# EAGLE design watch (EAGLE 7.2.0)

## Sheet 1 of 4: MCU & Power Management
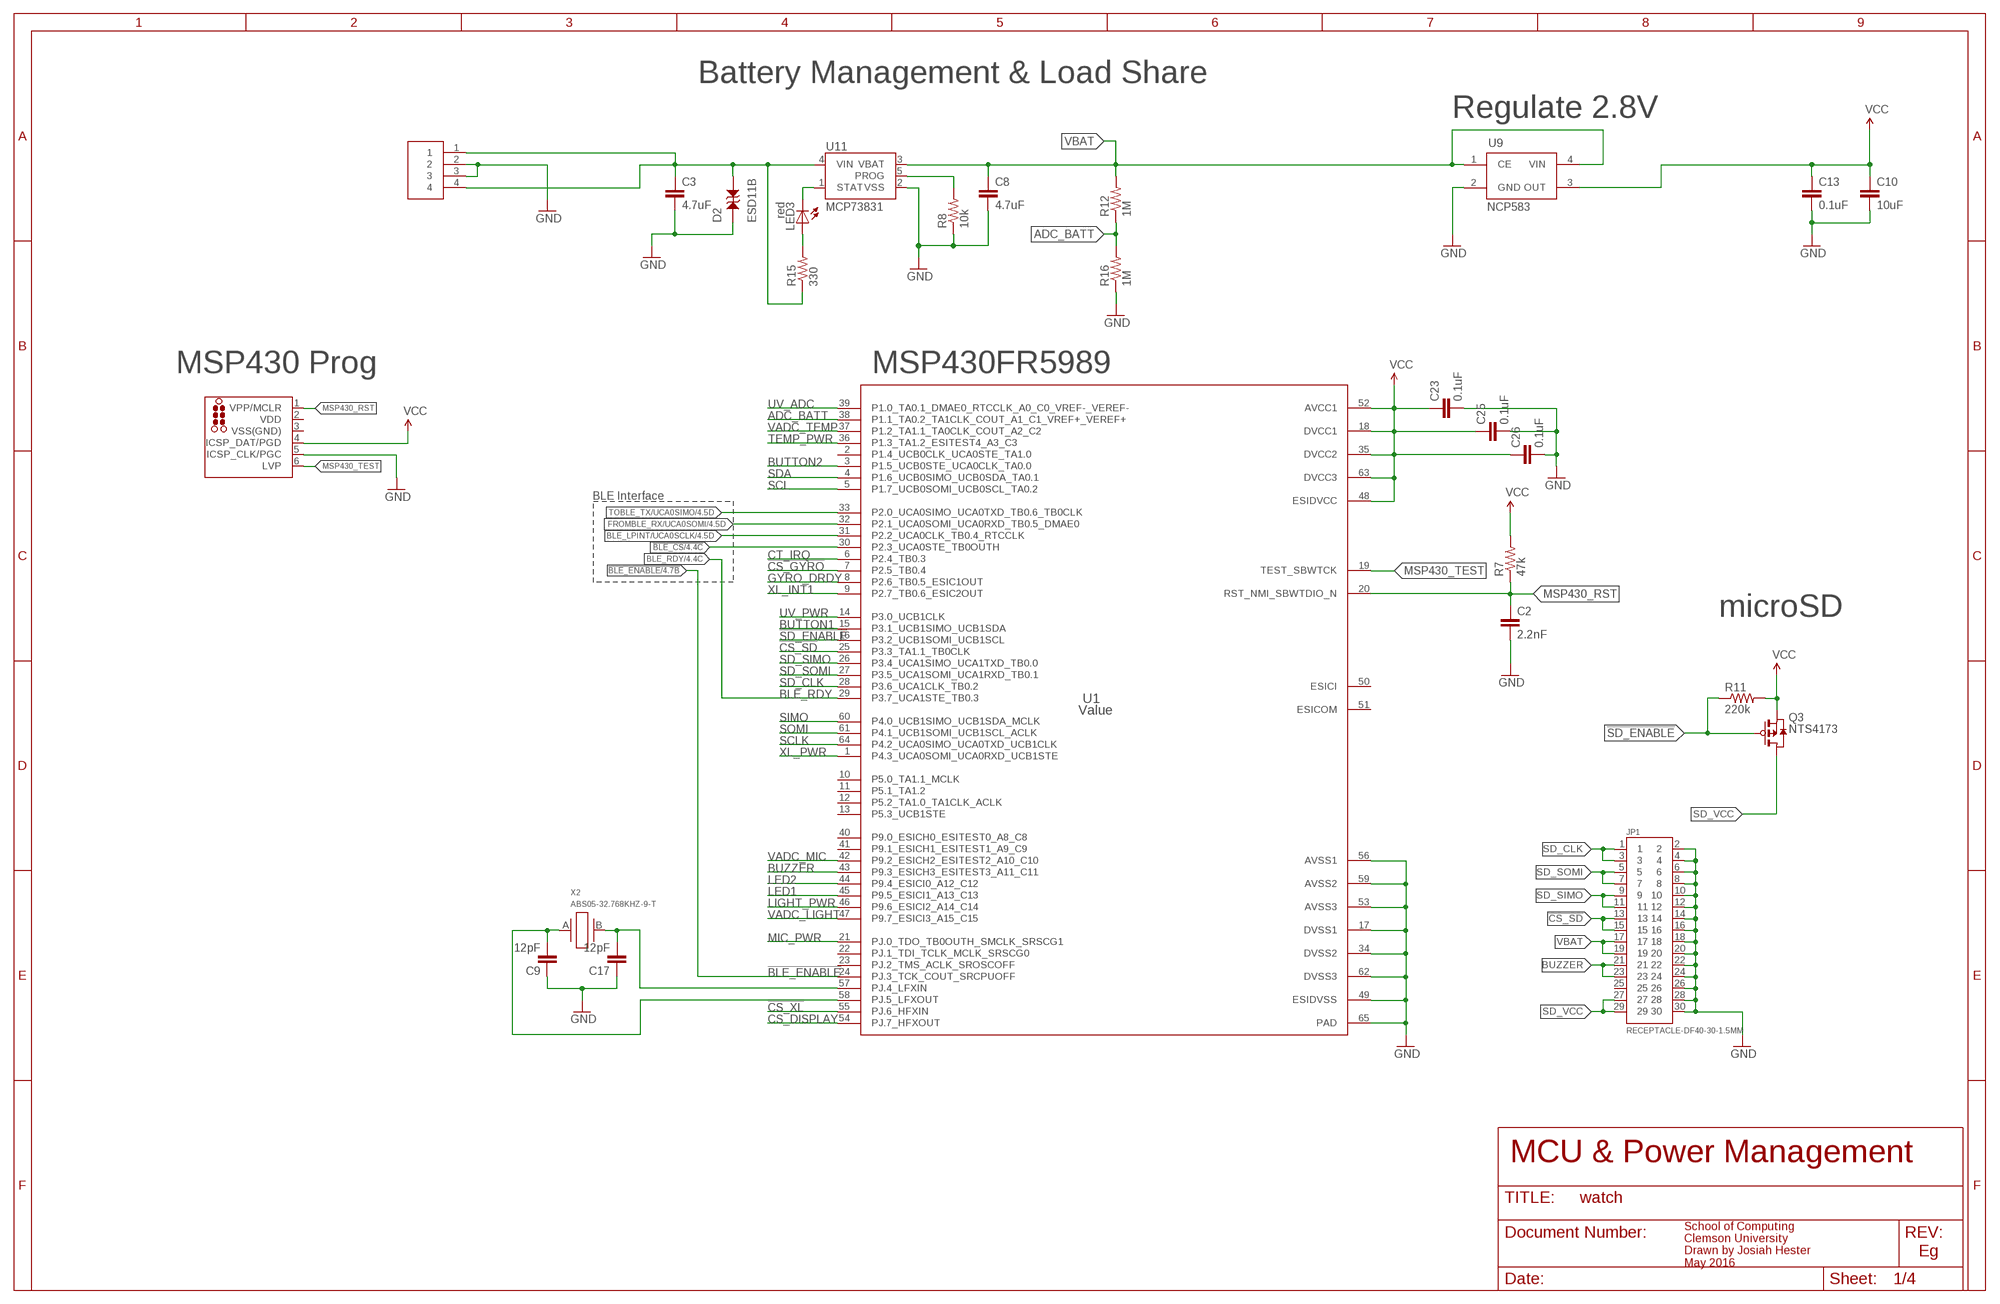
[diagram p0: schematic, sheet 1]

### Parts
C2  2.2nF  C-EU  [0402]
C3  4.7uF  CAP0805  [0805]
C8  4.7uF  CAP0805  [0805]
C9  12pF  C-EU  [0402]
C10  10uF  CAP0805  [0805]
C13  0.1uF  C-EU  [0402]
C17  12pF  C-EU  [0402]
C23  0.1uF  C-EU  [0402]
C25  0.1uF  C-EU  [0402]
C26  0.1uF  C-EU  [0402]
D2  ESD11B  [DSN2]
J1  TC2030-MCP-NL  [TC2030-MCP-NL]
JP1  RECEPTACLE-DF40-30-1.5MM  [RECEPTACLE-DF40-30-1.5MM]
JP3  1.27MM-MILLMAX  [1X03-1.27MM]
LED3  red  LED0603  [LED-0603]
Q3  NTS4173  [SC-70-3]
R7  47k  R-EU  [0402]
R8  10k  R-EU  [0402]
R11  220k  R-EU  [0402]
R12  1M  R-EU  [0402]
R15  330  R-EU  [0402]
R16  1M  R-EU  [0402]
U1  Value  MSP430FR5989IRGCR  [RGC0064B]
U9  NCP583  [SC82-AB_1PRIMARY]
U11  MCP73831  [SOT23-5]
X2  ABS05-32.768KHZ-9-T  [ABS05]

### Nets
!BLE_CS: U1.30(P2.3_UCA0STE_TB0OUTH) ; also sheet 4
!BLE_ENABLE: U1.24(PJ.3_TCK_COUT_SRCPUOFF) ; also sheet 4
!CS_GYRO: U1.7(P2.5_TB0.4) ; also sheet 3
!CS_SD: JP1.13 JP1.15 U1.25(P3.3_TA1.1_TB0CLK)
!CS_XL: U1.55(PJ.6_HFXIN) ; also sheet 3
!SD_ENABLE: Q3.P1(G) R11.1 U1.16(P3.2_UCB1SOMI_UCB1SCL)
ADC_BATT: R12.1 R16.2 U1.38(P1.1_TA0.2_TA1CLK_COUT_A1_C1_VREF+_VEREF+)
BLE_LPINT/UCA0SCLK: U1.31(P2.2_UCA0CLK_TB0.4_RTCCLK) ; also sheet 4
BLE_RDY: U1.29(P3.7_UCA1STE_TB0.3) ; also sheet 4
BUTTON1: U1.15(P3.1_UCB1SIMO_UCB1SDA) ; also sheet 2
BUTTON2: U1.3(P1.5_UCB0STE_UCA0CLK_TA0.0) ; also sheet 2
BUZZER: JP1.21 JP1.23 U1.43(P9.3_ESICH3_ESITEST3_A11_C11)
CS_DISPLAY: U1.54(PJ.7_HFXOUT) ; also sheet 2
CT_IRQ: U1.6(P2.4_TB0.3) ; also sheet 2
FROMBLE_RX/UCA0SOMI: U1.32(P2.1_UCA0SOMI_UCA0RXD_TB0.5_DMAE0) ; also sheet 4
GND: C2.2 C3.2 C8.2 C9.1 C10.2 C13.2 C17.1 C23.2 C25.2 C26.2 D2.P$1 J1.5(ICSP_CLK/PGC) JP1.2 JP1.4 JP1.6 JP1.8 JP1.10 JP1.12 JP1.14 JP1.16 JP1.18 JP1.20 JP1.22 JP1.24 JP1.26 JP1.28 JP1.30 JP3.2 JP3.3 R8.1 R16.1 U1.17(DVSS1) U1.34(DVSS2) U1.49(ESIDVSS) U1.53(AVSS3) U1.56(AVSS1) U1.59(AVSS2) U1.62(DVSS3) U1.65(PAD) U9.2(GND) U11.2(VSS) ; also sheet 2,3,4
GYRO_DRDY: U1.8(P2.6_TB0.5_ESIC1OUT) ; also sheet 3
LED1: U1.45(P9.5_ESICI1_A13_C13) ; also sheet 2
LED2: U1.44(P9.4_ESICI0_A12_C12) ; also sheet 2
LIGHT_PWR: U1.46(P9.6_ESICI2_A14_C14) ; also sheet 3
MIC_PWR: U1.21(PJ.0_TDO_TB0OUTH_SMCLK_SRSCG1) ; also sheet 3
MSP430_RST: C2.1 J1.1(VPP/MCLR) R7.1 U1.20(RST_NMI_SBWTDIO_N)
MSP430_TEST: J1.6(LVP) U1.19(TEST_SBWTCK)
N$3: R8.2 U11.5(PROG)
N$5: C17.2 U1.57(PJ.4_LFXIN) X2.B
N$6: C9.2 U1.58(PJ.5_LFXOUT) X2.A
N$7: LED3.C U11.1(STAT)
N$9: LED3.A R15.2
SCL: U1.5(P1.7_UCB0SOMI_UCB0SCL_TA0.2) ; also sheet 2
SCLK: U1.64(P4.2_UCA0SIMO_UCA0TXD_UCB1CLK) ; also sheet 2,3
SD_CLK: JP1.1 JP1.3 U1.28(P3.6_UCA1CLK_TB0.2)
SD_SIMO: JP1.9 JP1.11 U1.26(P3.4_UCA1SIMO_UCA1TXD_TB0.0)
SD_SOMI: JP1.5 JP1.7 U1.27(P3.5_UCA1SOMI_UCA1RXD_TB0.1)
SD_VCC: JP1.27 JP1.29 Q3.P3(D)
SDA: U1.4(P1.6_UCB0SIMO_UCB0SDA_TA0.1) ; also sheet 2
SIMO: U1.60(P4.0_UCB1SIMO_UCB1SDA_MCLK) ; also sheet 2,3
SOMI: U1.61(P4.1_UCB1SOMI_UCB1SCL_ACLK) ; also sheet 3
TEMP_PWR: U1.36(P1.3_TA1.2_ESITEST4_A3_C3) ; also sheet 3
TOBLE_TX/UCA0SIMO: U1.33(P2.0_UCA0SIMO_UCA0TXD_TB0.6_TB0CLK) ; also sheet 4
UV_ADC: U1.39(P1.0_TA0.1_DMAE0_RTCCLK_A0_C0_VREF-_VEREF-) ; also sheet 3
UV_PWR: U1.14(P3.0_UCB1CLK) ; also sheet 3
VADC_LIGHT: U1.47(P9.7_ESICI3_A15_C15) ; also sheet 3
VADC_MIC: U1.42(P9.2_ESICH2_ESITEST2_A10_C10) ; also sheet 3
VADC_TEMP: U1.37(P1.2_TA1.1_TA0CLK_COUT_A2_C2) ; also sheet 3
VBAT: C8.1 JP1.17 JP1.19 R12.2 U9.1(CE) U9.4(VIN) U11.3(VBAT)
VCC: C10.1 C13.1 C23.1 C25.1 C26.1 J1.4(ICSP_DAT/PGD) Q3.P2(S) R7.2 R11.2 U1.18(DVCC1) U1.35(DVCC2) U1.48(ESIDVCC) U1.52(AVCC1) U1.63(DVCC3) U9.3(OUT) ; also sheet 2,3,4
VIN: C3.1 D2.P$2 JP3.1 JP3.4 R15.1 U11.4(VIN)
XL_INT1: U1.9(P2.7_TB0.6_ESIC2OUT) ; also sheet 3
XL_PWR: U1.1(P4.3_UCA0SOMI_UCA0RXD_UCB1STE) ; also sheet 3
Unconnected: JP1.25 U1.2(P1.4_UCB0CLK_UCA0STE_TA1.0) U1.10(P5.0_TA1.1_MCLK) U1.11(P5.1_TA1.2) U1.12(P5.2_TA1.0_TA1CLK_ACLK) U1.13(P5.3_UCB1STE) U1.22(PJ.1_TDI_TCLK_MCLK_SRSCG0) U1.23(PJ.2_TMS_ACLK_SROSCOFF) U1.40(P9.0_ESICH0_ESITEST0_A8_C8) U1.41(P9.1_ESICH1_ESITEST1_A9_C9) U1.50(ESICI) U1.51(ESICOM)

### Notes on the sheet
- Battery Management & Load Share
- Regulate 2.8V
- MSP430 Prog | MSP430FR5989
- BLE Interface
- microSD
- MCU & Power Management
- Eg
- School of Computing
  Clemson University
  Drawn by Josiah Hester
  May 2016

## Sheet 2 of 4: User Interface
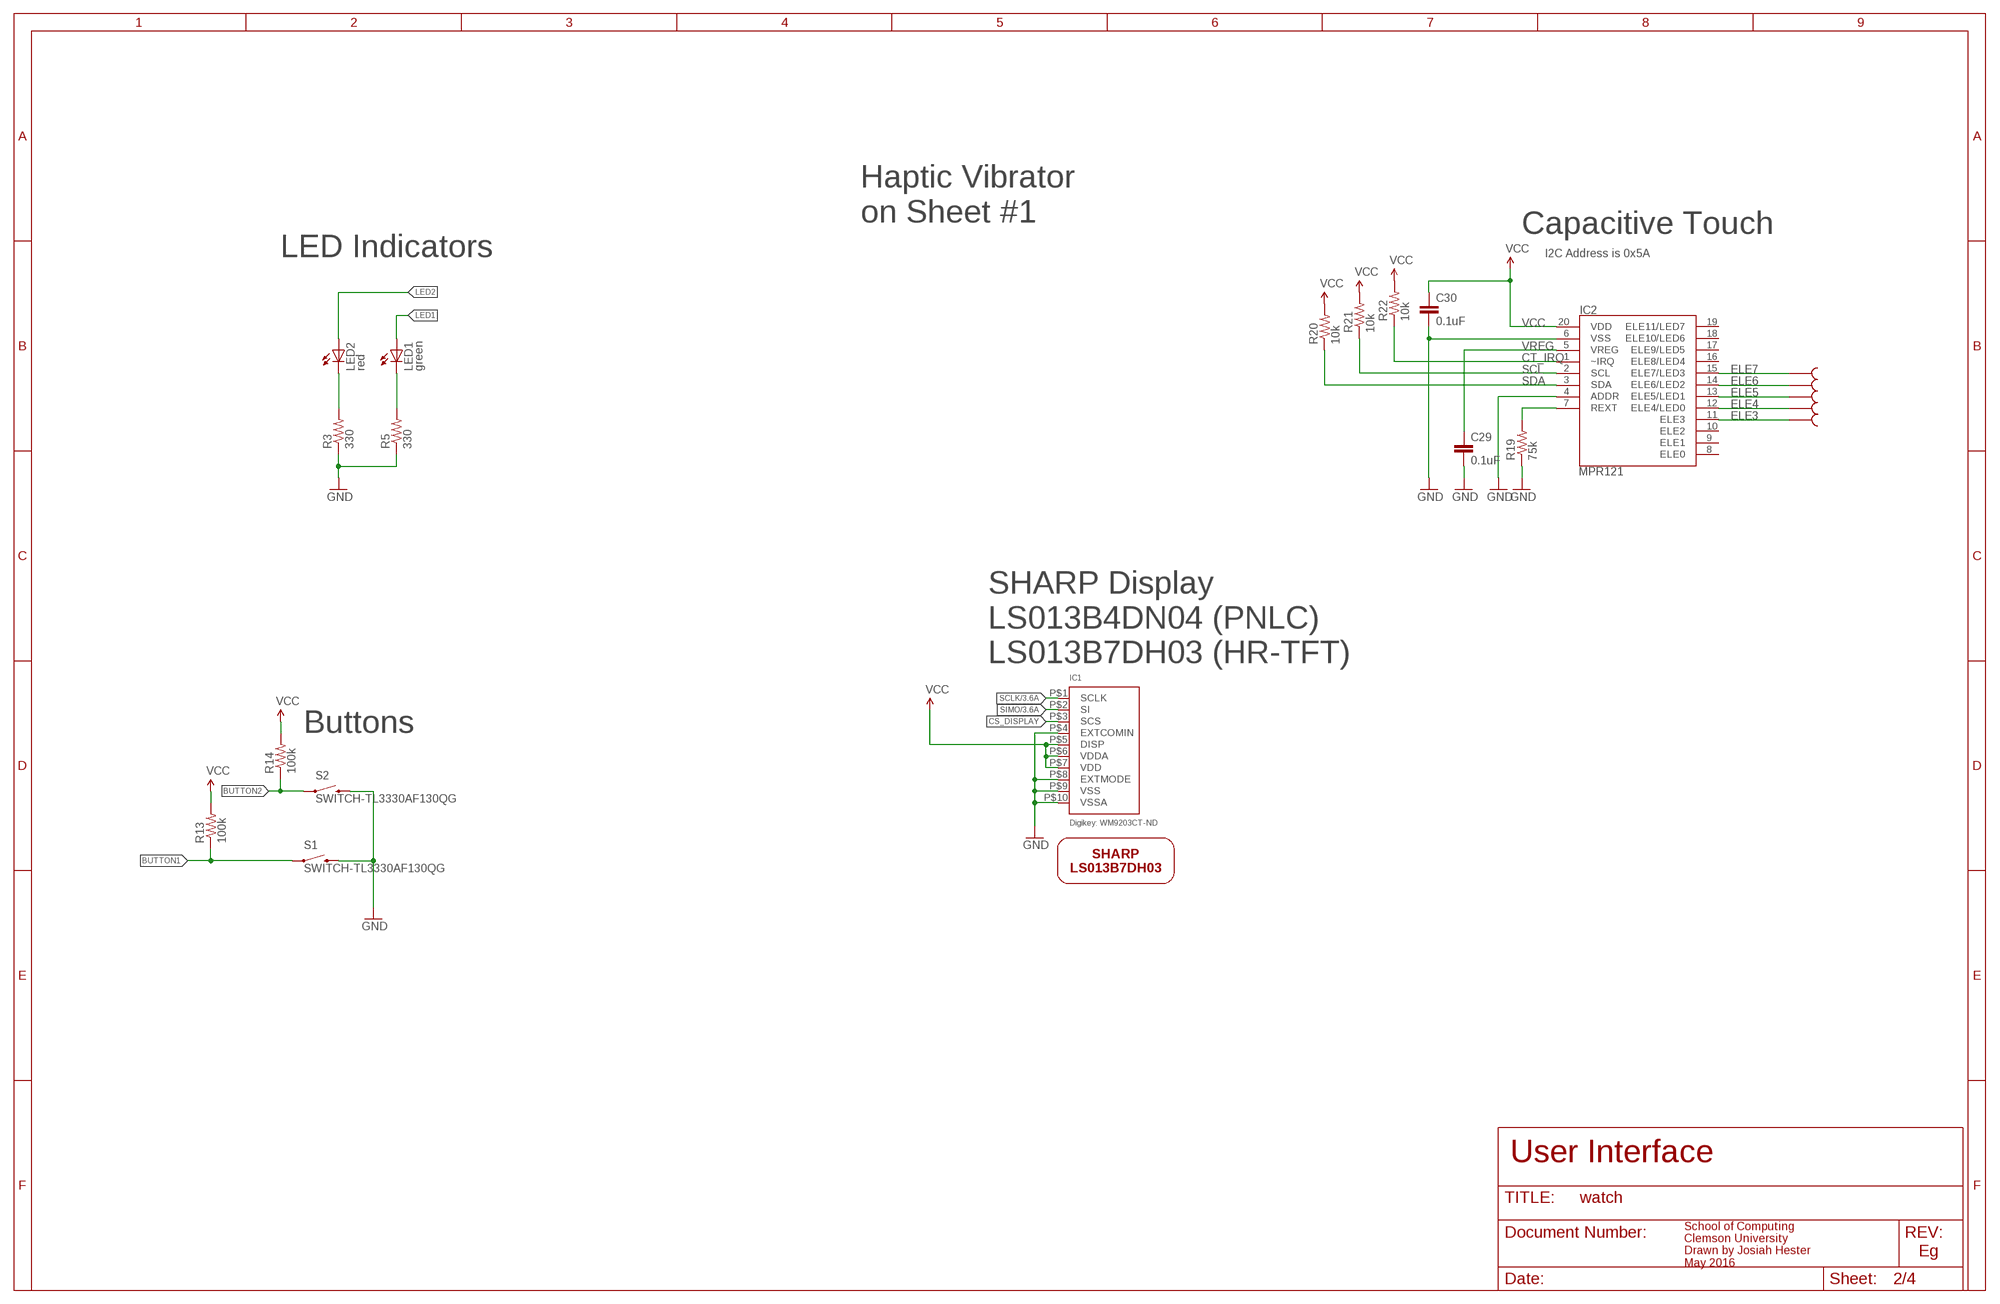
[diagram p1: schematic, sheet 2]

### Parts
C29  0.1uF  C-EU  [0402]
C30  0.1uF  C-EU  [0402]
IC1  Digikey: WM9203CT-ND  SHARP_MEMORYLCD_10PIN  [FPC_10PIN_52892-1095]
IC2  MPR121  MPR121V2  [QFN-20-0.4MM-V2]
LED1  green  LED0603  [LED-0603]
LED2  red  LED0603  [LED-0603]
R3  330  R-EU  [0402]
R5  330  R-EU  [0402]
R13  100k  R-EU  [0402]
R14  100k  R-EU  [0402]
R19  75k  R-EU  [0402]
R20  10k  R-EU  [0402]
R21  10k  R-EU  [0402]
R22  10k  R-EU  [0402]
S1  SWITCH-TL3330AF130QG  [TL3330AF130QG]
S2  SWITCH-TL3330AF130QG  [TL3330AF130QG]
U$3  LS013B7DH03  [LS013B7DH03_HF]
U$6  CTPAD  [CTPAD]
U$7  CTPAD  [CTPAD]
U$8  CTPAD  [CTPAD]
U$9  CTPAD  [CTPAD]
U$10  CTPAD  [CTPAD]

### Nets
BUTTON1: R13.1 S1.2 ; also sheet 1
BUTTON2: R14.1 S2.2 ; also sheet 1
CS_DISPLAY: IC1.P$3(SCS) ; also sheet 1
CT_IRQ: IC2.1(~IRQ) R22.1 ; also sheet 1
ELE3: IC2.11(ELE3) U$10.P$1
ELE4: IC2.12(ELE4/LED0) U$9.P$1
ELE5: IC2.13(ELE5/LED1) U$8.P$1
ELE6: IC2.14(ELE6/LED2) U$7.P$1
ELE7: IC2.15(ELE7/LED3) U$6.P$1
GND: C29.2 C30.2 IC1.P$4(EXTCOMIN) IC1.P$8(EXTMODE) IC1.P$9(VSS) IC1.P$10(VSSA) IC2.4(ADDR) IC2.6(VSS) R3.1 R5.1 R19.1 S1.1 S2.1 ; also sheet 1,3,4
LED1: LED1.A ; also sheet 1
LED2: LED2.A ; also sheet 1
N$1: LED2.C R3.2
N$2: LED1.C R5.2
REXT: IC2.7(REXT) R19.2
SCL: IC2.2(SCL) R21.1 ; also sheet 1
SCLK: IC1.P$1(SCLK) ; also sheet 1,3
SDA: IC2.3(SDA) R20.1 ; also sheet 1
SIMO: IC1.P$2(SI) ; also sheet 1,3
VCC: C30.1 IC1.P$5(DISP) IC1.P$6(VDDA) IC1.P$7(VDD) IC2.20(VDD) R13.2 R14.2 R20.2 R21.2 R22.2 ; also sheet 1,3,4
VREG: C29.1 IC2.5(VREG)
Unconnected: IC2.8(ELE0) IC2.9(ELE1) IC2.10(ELE2) IC2.16(ELE8/LED4) IC2.17(ELE9/LED5) IC2.18(ELE10/LED6) IC2.19(ELE11/LED7)

### Notes on the sheet
- Haptic Vibrator
  on Sheet #1
- Capacitive Touch
- LED Indicators | I2C Address is 0x5A
- SHARP Display
  LS013B4DN04 (PNLC)
  LS013B7DH03 (HR-TFT)
- Buttons
- User Interface
- Eg
- School of Computing
  Clemson University
  Drawn by Josiah Hester
  May 2016

## Sheet 3 of 4: Sensors
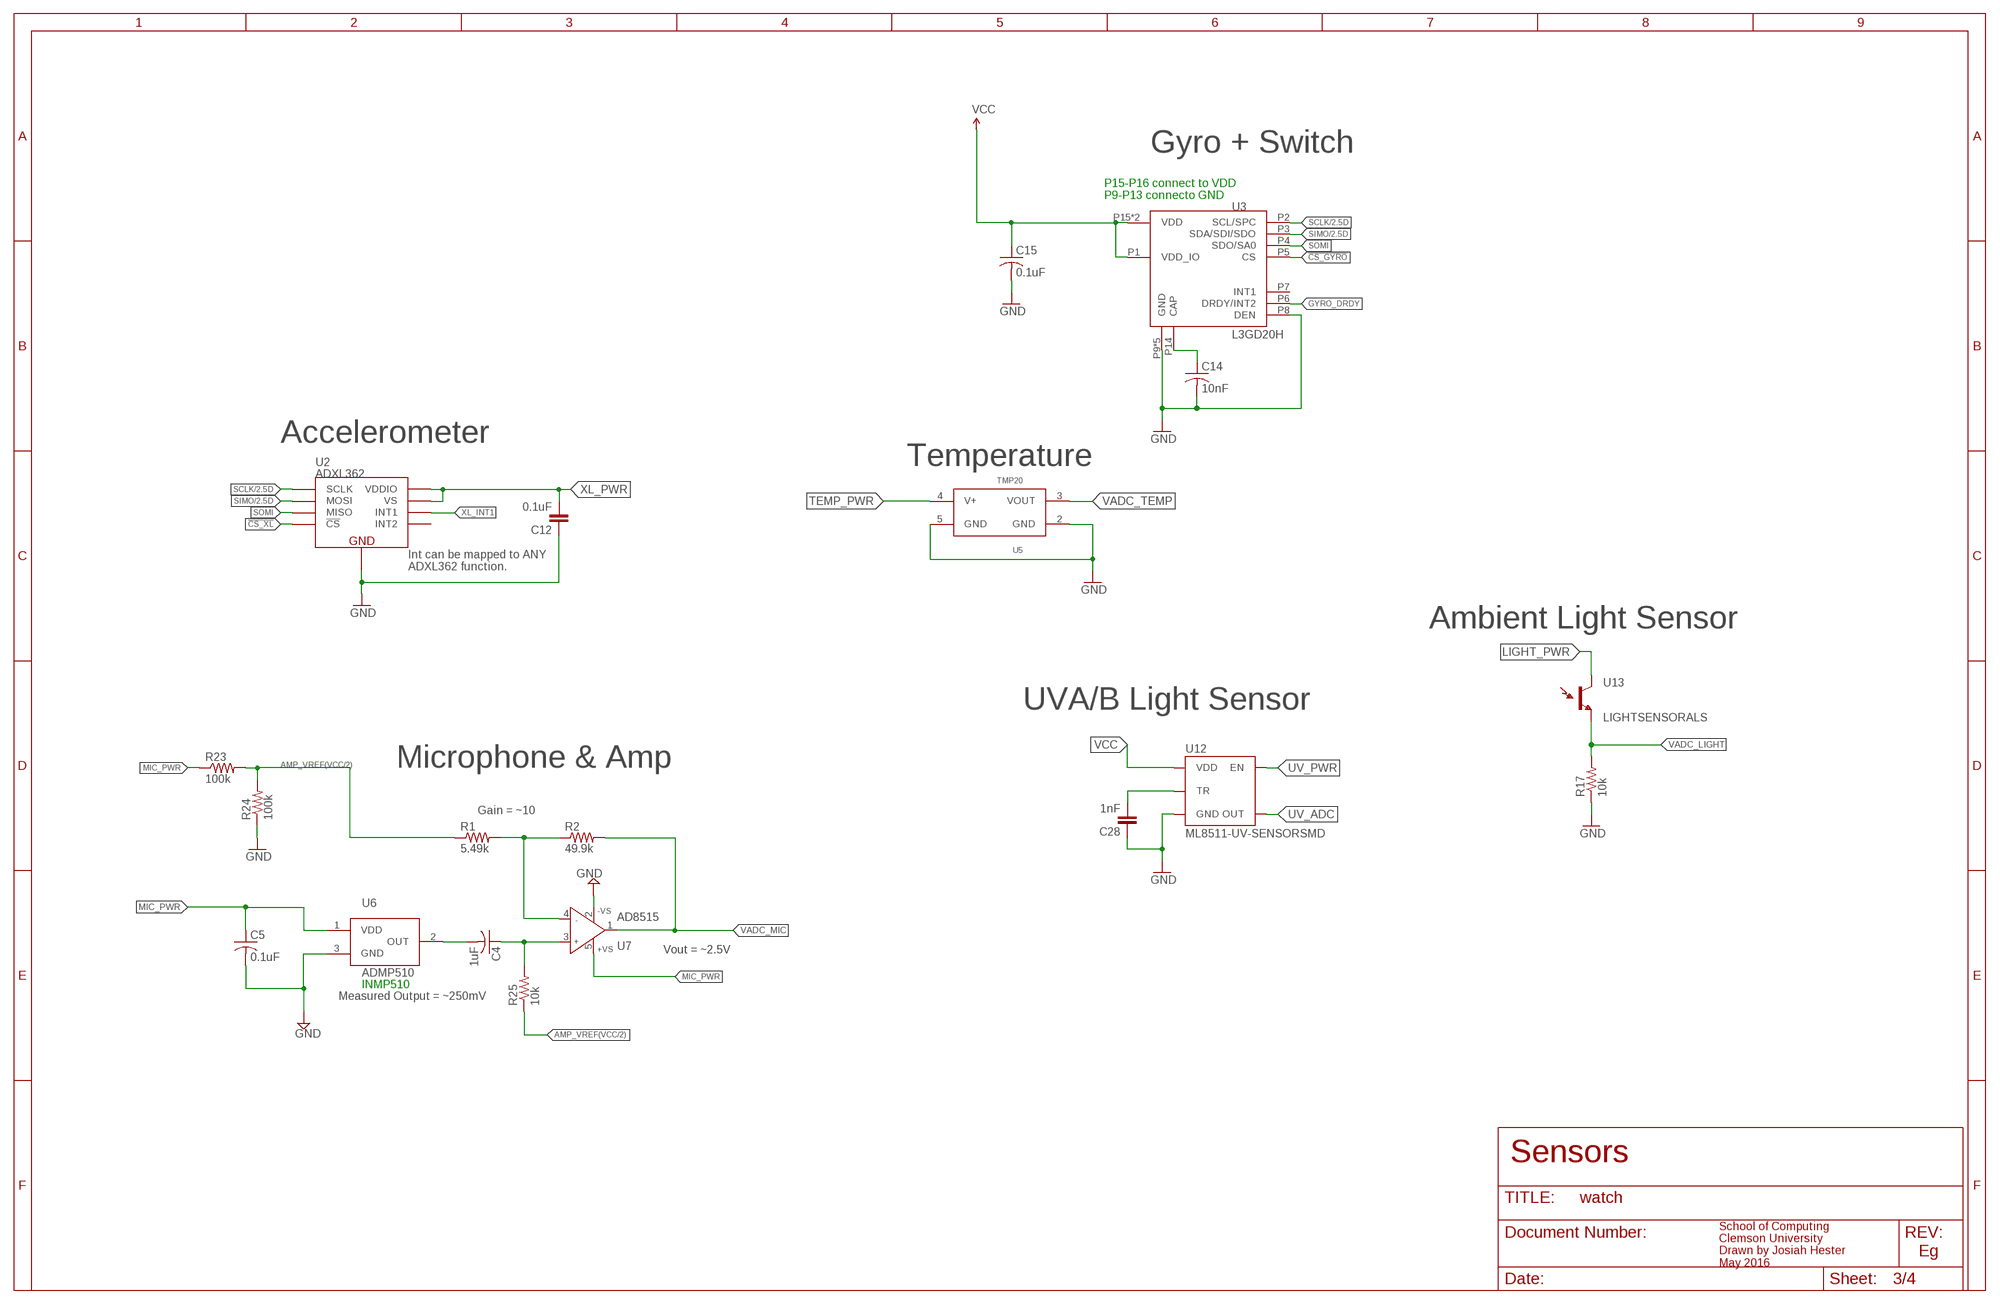
[diagram p2: schematic, sheet 3]

### Parts
C4  1uF  C-US0402  [0402]
C5  0.1uF  C-US0402  [0402]
C12  0.1uF  C-EU  [0402]
C14  10nF  C-US0402  [0402]
C15  0.1uF  C-US0402  [0402]
C28  1nF  C-EU  [0402]
R1  5.49k  R-US_0402  [0402]
R2  49.9k  R-US_0402  [0402]
R17  10k  R-US_0402  [0402]
R23  100k  R-US_0402  [0402]
R24  100k  R-US_0402  [0402]
R25  10k  R-US_0402  [0402]
U2  ADXL362  [ADXL362]
U3  L3GD20H  [LGA16L]
U5  TMP20  [SC70-5L]
U6  ADMP510  [ADMP510]
U7  AD8515  [SOT23-5]
U12  ML8511-UV-SENSORSMD  [ML8511]
U13  LIGHTSENSORALS  [ALS-PT19]

### Nets
!CS_GYRO: U3.P5(CS) ; also sheet 1
!CS_XL: U2.P$8(!CS) ; also sheet 1
AMP_VREF(VCC/2): R1.P$1 R23.P$2 R24.P$2 R25.P$1
GND: C5.P$2 C12.1 C14.P$2 C15.P$2 C28.1 R17.P$1 R24.P$1 U2.P$12(GND) U2.P$13(GND) U2.P$16(GND) U3.P8(DEN) U3.P9(GND) U3.P10(GND) U3.P11(GND) U3.P12(GND) U3.P13(GND) U5.2(GND) U5.5(GND) U6.3(GND) U7.2(-VS) U12.5(GND) ; also sheet 1,2,4
GYRO_DRDY: U3.P6(DRDY/INT2) ; also sheet 1
LIGHT_PWR: U13.C(C1) ; also sheet 1
MIC_AMP-: R1.P$2 R2.P$1 U7.4(IN-)
MIC_OUT: C4.P$2 U6.2(OUT)
MIC_PWR: C5.P$1 R23.P$1 U6.1(VDD) U7.5(+VS) ; also sheet 1
N$8: C14.P$1 U3.P14(CAP)
N$38: C28.2 U12.10(TR)
N$41: C4.P$1 R25.P$2 U7.3(IN+)
SCLK: U2.P$4(SCLK) U3.P2(SCL/SPC) ; also sheet 1,2
SIMO: U2.P$6(MOSI) U3.P3(SDA/SDI/SDO) ; also sheet 1,2
SOMI: U2.P$7(MISO) U3.P4(SDO/SA0) ; also sheet 1
TEMP_PWR: U5.4(V+) ; also sheet 1
UV_ADC: U12.8(OUT) ; also sheet 1
UV_PWR: U12.4(EN) ; also sheet 1
VADC_LIGHT: R17.P$2 U13.E(E1) ; also sheet 1
VADC_MIC: R2.P$2 U7.1(OUT) ; also sheet 1
VADC_TEMP: U5.3(VOUT) ; also sheet 1
VCC: C15.P$1 U3.P1(VDD_IO) U3.P15(VDD) U3.P16(VDD) U12.7(VDD) ; also sheet 1,2,4
XL_INT1: U2.P$11(INT1) ; also sheet 1
XL_PWR: C12.2 U2.P$1(VDDIO) U2.P$14(VS) ; also sheet 1
Unconnected: U2.P$9(INT2) U3.P7(INT1)

### Notes on the sheet
- Gyro + Switch
- P15-P16 connect to VDD
  P9-P13 connecto GND
- Accelerometer
- Temperature
- Int can be mapped to ANY
  ADXL362 function.
- Ambient Light Sensor
- UVA/B Light Sensor
- Microphone & Amp
- Gain = ~10
- Vout = ~2.5V
- INMP510
- Measured Output = ~250mV
- Sensors
- Eg
- School of Computing
  Clemson University
  Drawn by Josiah Hester
  May 2016

## Sheet 4 of 4: Comms -- BLE
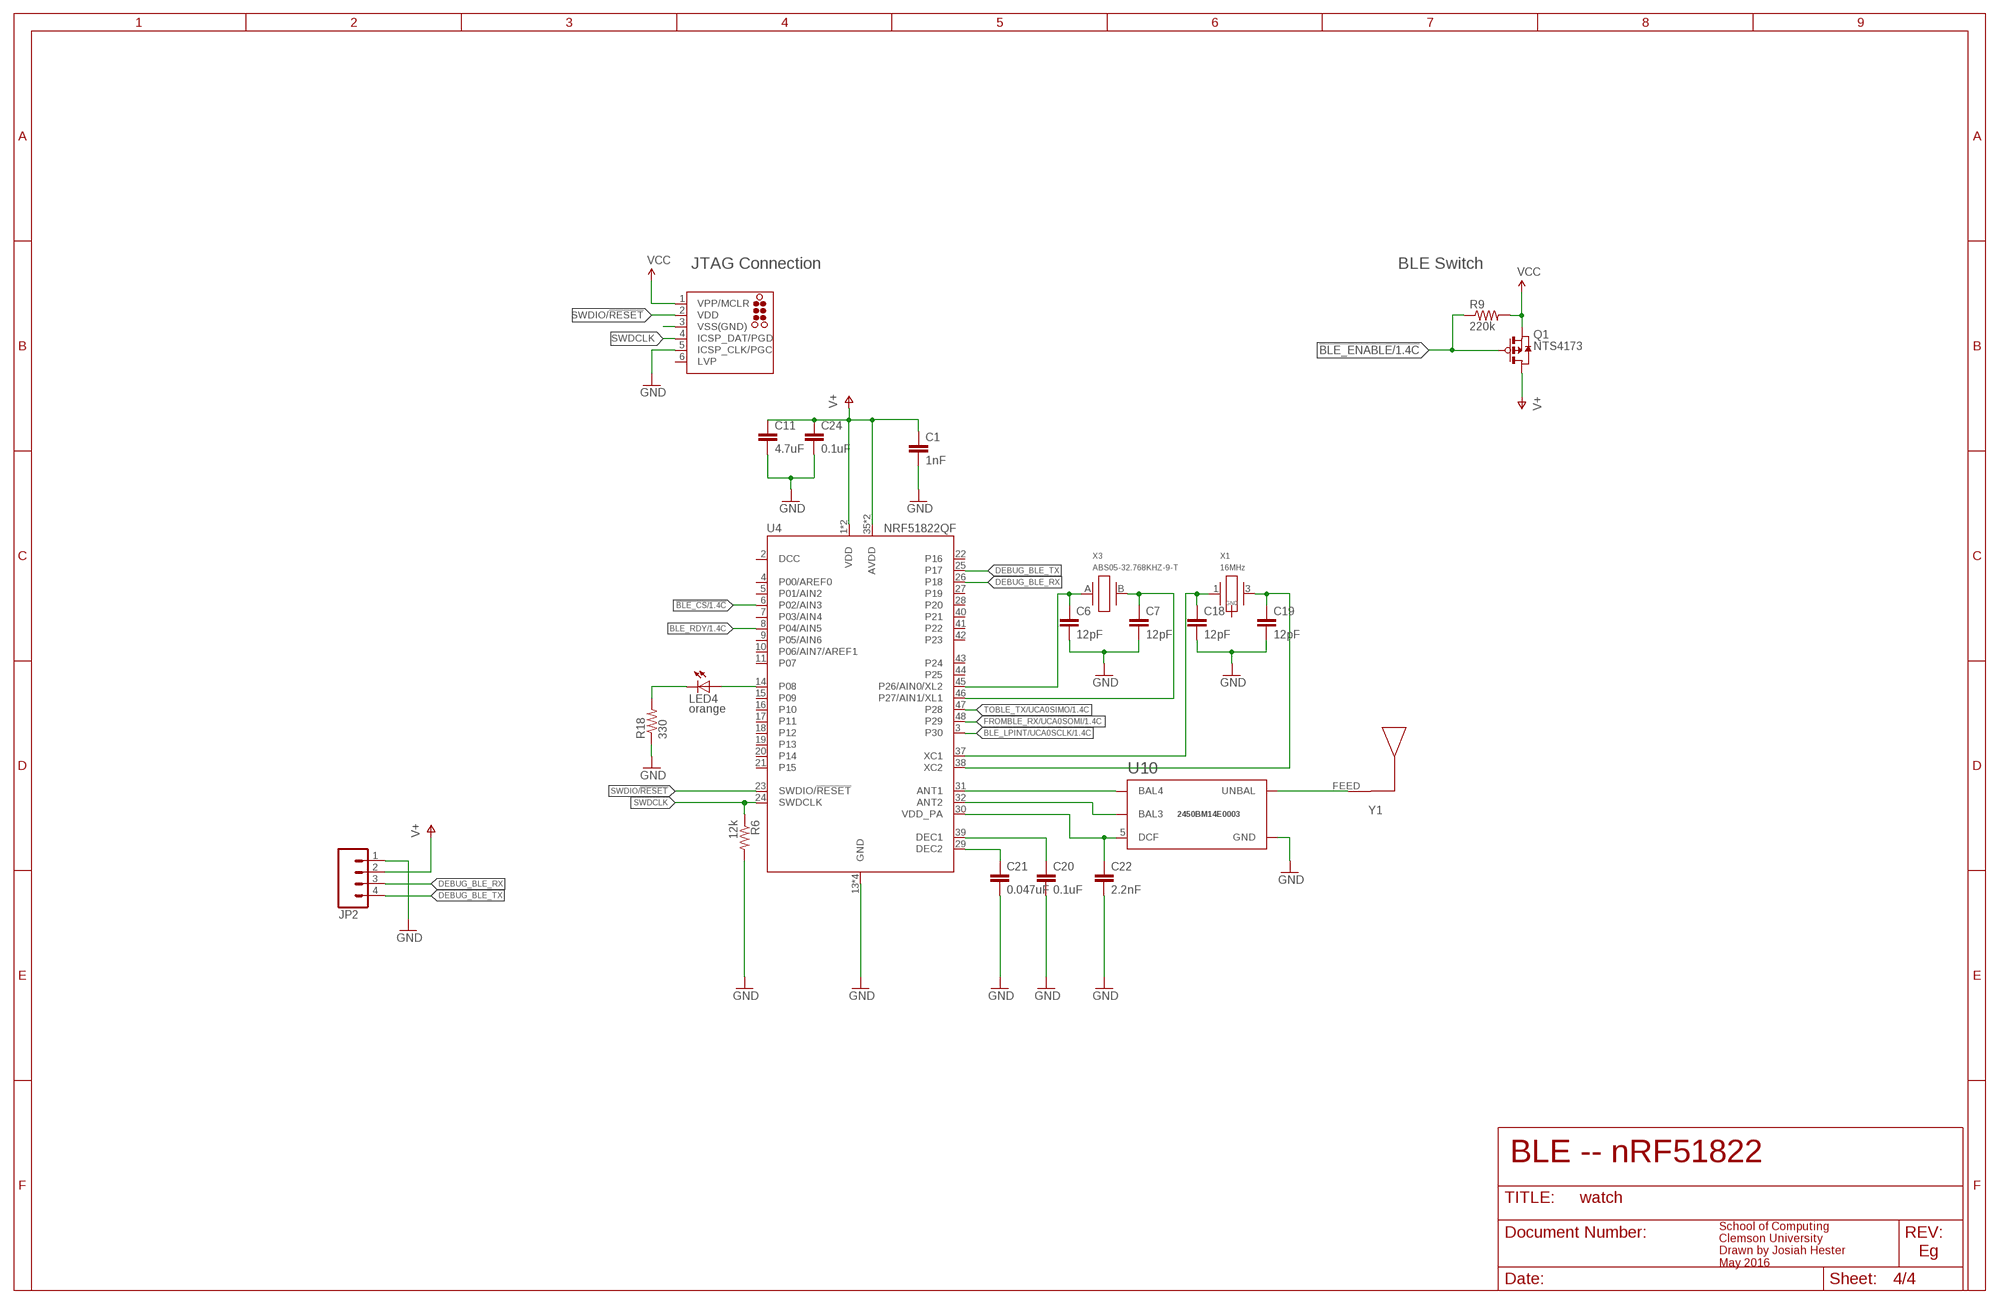
[diagram p3: schematic, sheet 4]

### Parts
C1  1nF  C-EU  [0402]
C6  12pF  C-EU  [0402]
C7  12pF  C-EU  [0402]
C11  4.7uF  CAP0805  [0805]
C18  12pF  C-EU  [0402]
C19  12pF  C-EU  [0402]
C20  0.1uF  C-EU  [0402]
C21  0.047uF  C-EU  [0402]
C22  2.2nF  C-EU  [0402]
C24  0.1uF  C-EU  [0402]
J3  TC2030-NODRILLS  [TC2030-MCP-NODRILLS]
JP2  M041.27MM  [1X04-1.27MM]
LED4  orange  LED0603  [LED-0603]
Q1  NTS4173  [SC-70-3]
R6  12k  R-EU  [0402]
R9  220k  R-EU  [0402]
R18  330  R-EU  [0402]
U4  NRF51822QF  [QFN-48-6MM]
U10  2450BM14E0003  [2450BM14E0003]
X1  16MHz  TXC-8Y  [TXC-8Y]
X3  ABS05-32.768KHZ-9-T  [ABS05]
Y1  2450AT42A100E  [2450AT42A100]

### Nets
!BLE_CS: U4.6(P02/AIN3) ; also sheet 1
!BLE_ENABLE: Q1.P1(G) R9.1 ; also sheet 1
BLE_LPINT/UCA0SCLK: U4.3(P30) ; also sheet 1
BLE_RDY: U4.8(P04/AIN5) ; also sheet 1
DEBUG_BLE_RX: JP2.3 U4.26(P18)
DEBUG_BLE_TX: JP2.4 U4.25(P17)
FROMBLE_RX/UCA0SOMI: U4.48(P29) ; also sheet 1
GND: C1.2 C6.2 C7.2 C11.2 C18.2 C19.2 C20.2 C21.2 C22.2 C24.2 J3.5(ICSP_CLK/PGC) JP2.1 R6.2 R18.1 U4.13(GND) U4.33(GND) U4.34(GND) U4.GND U10.2(GND) U10.6(GND) ; also sheet 1,2,3
N$10: U10.1(UNBAL) Y1.FEED(P1)
N$11: C22.1 U4.30(VDD_PA) U10.5(DCF)
N$12: U4.31(ANT1) U10.4(BAL4)
N$19: C6.1 U4.45(P26/AIN0/XL2) X3.A
N$20: C7.1 U4.46(P27/AIN1/XL1) X3.B
N$29: U4.32(ANT2) U10.3(BAL3)
N$31: C18.1 U4.37(XC1) X1.1
N$32: C19.1 U4.38(XC2) X1.3
N$33: C20.1 U4.39(DEC1)
N$34: C21.1 U4.29(DEC2)
N$36: LED4.C R18.2
N$37: LED4.A U4.14(P08)
NNUNOAUSDOASND: J3.3(VSS(GND))
SWDCLK: J3.4(ICSP_DAT/PGD) R6.1 U4.24(SWDCLK)
SWDIO/!RESET: J3.2(VDD) U4.23(SWDIO/!RESET)
TOBLE_TX/UCA0SIMO: U4.47(P28) ; also sheet 1
V+: C1.1 C11.1 C24.1 JP2.2 Q1.P3(D) U4.1(VDD) U4.12(VDD) U4.35(AVDD) U4.36(AVDD)
VCC: J3.1(VPP/MCLR) Q1.P2(S) R9.2 ; also sheet 1,2,3
Unconnected: J3.6(LVP) U4.2(DCC) U4.4(P00/AREF0) U4.5(P01/AIN2) U4.7(P03/AIN4) U4.9(P05/AIN6) U4.10(P06/AIN7/AREF1) U4.11(P07) U4.15(P09) U4.16(P10) U4.17(P11) U4.18(P12) U4.19(P13) U4.20(P14) U4.21(P15) U4.22(P16) U4.27(P19) U4.28(P20) U4.40(P21) U4.41(P22) U4.42(P23) U4.43(P24) U4.44(P25) X1.2(GND) X1.4(GND)

### Notes on the sheet
- JTAG Connection | BLE Switch
- BLE -- nRF51822
- Eg
- School of Computing
  Clemson University
  Drawn by Josiah Hester
  May 2016

## Power pins joined to a net without a drawn wire
VDD: J1.2(VDD)
VSS(GND): J1.3(VSS(GND))

## Library data of the parts
C1 C20 = tiny_passives:C-EU; DIGIKEY: 490-1303-1-ND
C2 C9 C12 C13 C17 C23 C25 C26 C28-C30 = tiny_passives:C-EU
C3 C8 C10 = SparkFun-Capacitors:CAP: Capacitor Standard 0603 ceramic capacitor, and 0.1" leaded capacitor.
C4 C5 C14 C15 = rcl:C-US: CAPACITOR, American symbol
C6 C7 C18 C19 = tiny_passives:C-EU; DIGIKEY: 490-6197-1-ND
C11 = SparkFun-Capacitors:CAP: Capacitor Standard 0603 ceramic capacitor, and 0.1" leaded capacitor.; DIGIKEY: 445-5947-1-ND
C21 = tiny_passives:C-EU; DIGIKEY: 445-1264-1-ND
C22 = tiny_passives:C-EU; DIGIKEY: 490-5419-1-ND
C24 = tiny_passives:C-EU; DIGIKEY: 445-4952-1-ND
D2 = esd11b:ESD11B: Transient Voltage Suppressor, Micro Packaged diodes for ESD protection DSN Package Datasheet: http://www.onsemi.com/pub_link/Collateral/ESD11B-D.PDF
IC1 = sharp_lcd:SHARP_MEMORYLCD_10PIN: Sharp Mono Memory LCD LS013B4DN02 - 1.35" 96x96 Pixels LS027B7DH01 - 2.7" 400x240 Pixels
IC2 = Testing:MPR121: MPR121 Capacitive Touch Sensor Controller. Variant "V2" was created using an image import of the bottom of the IC. It matches metal to metal.; ARROW: MPR121QR2
J1 J3 = tag-connect_msp430:TC2030: TAG-CONNECT ICSP Connector Manufacturer: Tag-Connect <http://www.tag-connect.com> Cable for easy In-Circuit Serial Programming. Designed for Microchip ICD2, suitable for many others. Two variants - one "with legs" (for hands-free fit on PCB) and another "without legs" for quick programming. PAD Description 1 MCLR/Vpp 2 Vdd 3 GND 4 PGD (ISPDAT) 5 PGC (ISPCLK) 6 nc (used for LVP) ©2009 ROFA.cz - modified and updated by Robert Darlington ‹rdarlington@gmail.com›
JP1 = connectors:RECEPTACLE-DF40-30-1.5MM: DF0 Series●0.4mm Pitch, 1.5 to 4.0mm Height, Board-to-Board and Board-to-FPC Connectors Receptacle (Stacking height 1.5mm, with shield) Digi-Key Part Number H11623CT-ND Manufacturer Hirose Electric Co Ltd </en/supplier-centers/h/hirose> Manufacturer Part Number DF40C-30DS-0.4V(51) Description CONN RCPT 30POS 0.4MM SMD GOLD Lead Free Status / RoHS Status Lead free / RoHS Compliant Moisture Sensitivity Level (MSL) 1 (Unlimited) Manufacturer Standard Lead Time 8 Weeks; DIGIKEY: H11623CT-ND
JP2 = SparkFun-Connectors:M04: Header 4 Standard 4-pin 0.1" header. Use with straight break away headers (SKU : PRT-00116), right angle break away headers (PRT-00553), swiss pins (PRT-00743), machine pins (PRT-00117), and female headers (PRT-00115). Molex polarized connector foot print use with SKU : PRT-08231 with associated crimp pins and housings. 1MM SMD Version SKU: PRT-10208
JP3 = 1.27mm-headers:1.27MM-MILLMAX: Manafacturer: Mill-Max Manufacturing Corp. Manafacturer Part #: 851-13-004-40-001000 Description: 4 Position Receptacle Connector 0.050" (1.27mm) Surface Mount, Right Angle Gold
LED1-LED3 = SparkFun-LED:LED: LEDs Standard schematic elements and footprints for 5mm, 3mm, 1206, and 0603 sized LEDs. 5mm - Spark Fun Electronics SKU : COM-00529 (and others)
LED4 = SparkFun-LED:LED: LEDs Standard schematic elements and footprints for 5mm, 3mm, 1206, and 0603 sized LEDs. 5mm - Spark Fun Electronics SKU : COM-00529 (and others); DIGIKEY: 160-1445-1-ND
Q1 Q3 = nts4173p:NTS4173: NTS4173P: Power MOSFET −30 V, −1.3 A, Single P−Channel, SC−70 Features • −30 V BVds, Low RDS(on) in SC−70 Package • Low Threshold Voltage • Fast Switching Speed • This is a Halide−Free Device • This is a Pb−Free Device Applications • Load Switch • Low Current Inverter and DC−DC Converters • Power Switch for Printers, Communication Equipment; DIGIKEY: NTS4173PT1GOSCT-ND
R1 R2 R23-R25 = rcl:R-US_: RESISTOR, American symbol
R3 R5 R7 R8 R12-R16 R18 R20-R22 = tiny_passives:R-EU
R6 R9 R11 = tiny_passives:R-EU; DIGIKEY: RHM12.0KCDCT-ND
R17 = rcl:R-US_: RESISTOR, American symbol; DIGIKEY: 311-4.7KJRCT-ND
R19 = tiny_passives:R-EU; DIGIKEY: 311-75KLRCT-ND
S1 = right_angle_switch:SWITCH-TL3330AF130QG: Right Angle Tactile Button, Surface Mount Digikey: EG4388CT-ND Manufacturer Part Number: TL3330AF130QG Description: SWITCH TACTILE SPST-NO 0.05A 12V
S2 = right_angle_switch:SWITCH-TL3330AF130QG: Right Angle Tactile Button, Surface Mount Digikey: EG4388CT-ND Manufacturer Part Number: TL3330AF130QG Description: SWITCH TACTILE SPST-NO 0.05A 12V; DIGIKEY: EG4388CT-ND
U1 = msp430fr5989:MSP430FR5989IRGCR; ALTERNATEPARTNUMBER: MSP430FR5989IRGCT; COMPTYPE: IC; DIGIKEY: 296-42031-1-ND; MANUFACTURER: Texas Instruments; MOUNTTYPE: SMT; PACKAGEREFERENCE: RGC0064B; PARTNUMBER: MSP430FR5989IRGCR; PIN_COUNT: 65; REFDES: RefDes; ROHS: Y; TYPE: TYPE
U2 = adxl362:ADXL362: Micropower 3-axis accelerometer 2/4/8g digital output (SPI)
U3 = l3gd20h:L3GD20H: L3GD20H: MEMS motion sensor: three-axis digital output gyroscope The L3GD20H is a low-power three-axis angular rate sensor. It includes a sensing element and an IC interface able to provide the measured angular rate to the external world through digital interface (I2C/SPI). The sensing element is manufactured using a dedicated micromachining process developed by ST to produce inertial sensors and actuators on silicon wafers. The IC interface is manufactured using a CMOS process that allows a high level of integration to design a dedicated circuit which is trimmed to better match the sensing element characteristics. The L3GD20H has a full scale of ±245/±500/±2000 dps and is capable of measuring rates with a user selectable bandwidth. The L3GD20H is available in a plastic land grid array (LGA) package and can operate within a temperature range from -40 °C to +85 °C.
U4 = chips:NRF51822: Multiprotocol Bluetooth® 4.0 low energy/2.4 GHz RF SoC; DIGIKEY: 1490-1042-1-ND; MOUSER: 949-NRF51822-QFAB-R7
U5 = tmp20:TMP20: TMP20 Temperature Sensor Datasheet: http://www.ti.com/lit/ds/symlink/tmp20.pdf
U6 = admp510:ADMP510: ADMP510: RF Hardened, Ultralow Noise Microphone with Bottom Port and Analog Output The ADMP510* is an RF hardened, analog output, bottomported, omnidirectional MEMS microphone with high performance, ultralow noise, and low power. The ADMP510 consists of a MEMS microphone element, an impedance converter, and an output amplifier. The ADMP510 sensitivity specification makes it an excellent choice for both near-field and far-field applications. The ADMP510 is pin compatible with the ADMP504 microphone. The ADMP510 has a very high signal-to-noise ratio (SNR) and extended wideband frequency response, resulting in natural sound with high intelligibility. Low current consumption enables long battery life for portable applications.
U7 = analog-devices:AD8515
U9 = ncp583:NCP583: NCP583 - Ultra-Low Iq 150 mA CMOS LDO Regulator with Enable The NCP583 series of low dropout regulators are designed for portable battery powered applications which require precise output voltage accuracy and low quiescent current. These devices feature an enable function which lowers current consumption significantly and are offered in two small packages; SC−82AB and the SOT−563. A 1.0 mF ceramic capacitor is the recommended value to be used with these devices on the output pin.
U10 = johansen-baluns:2450BM14E0003: 2.45GHz Impedance Matched Balun + Band Pass Filter: Optimized for Nordic's Chipsets: nRF51822-QFAA, nRF51422-QFAA, nRF51822-QFAB, nRF51422-QFAB, nRF51822-QFAC, and nRF51422-QFAC
U11 = SparkFun:MCP73831: Microchip's MCP73831 Miniature single cell, fully integrated Li-Ion, Li-polymer charge management controller http://ww1.microchip.com/downloads/en/DeviceDoc/21984a.pdf
U12 = SparkFun-Sensors:ML8511-UV-SENSOR; PROD_ID: IC-11927
U13 = SparkFun-Sensors:LIGHTSENSOR: Ambient Light Sensor Simple light detection sensor. Output varies with light intensity input. Spark Fun Electronics SKU : COM-08348; DIGIKEY: 1080-1244-1-ND; PROD_ID: IC-11836
U$3 = sharp_screens:LS013B7DH03: Sharp Microelectronics TFT Displays & Accessories 1.28" Memory LCD 128x128 Tranf HR-TFT
U$6-U$10 = captouch:CTPAD
X1 = crystals:TXC-8Y: 2mmx1.6mm SMD Crystal; DIGIKEY: 887-2003-1-ND
X2 X3 = abs05:ABS05-32.768KHZ: 32.768kHz Crystal; DIGIKEY: 535-11897-1-ND
Y1 = johanson-antenna:2450AT42A100E: Johanson Technology Inc. 2450AT42A100E ANTENNA CHIP 2.4GHZ; DIGIKEY: 712-1007-1-ND

## Board
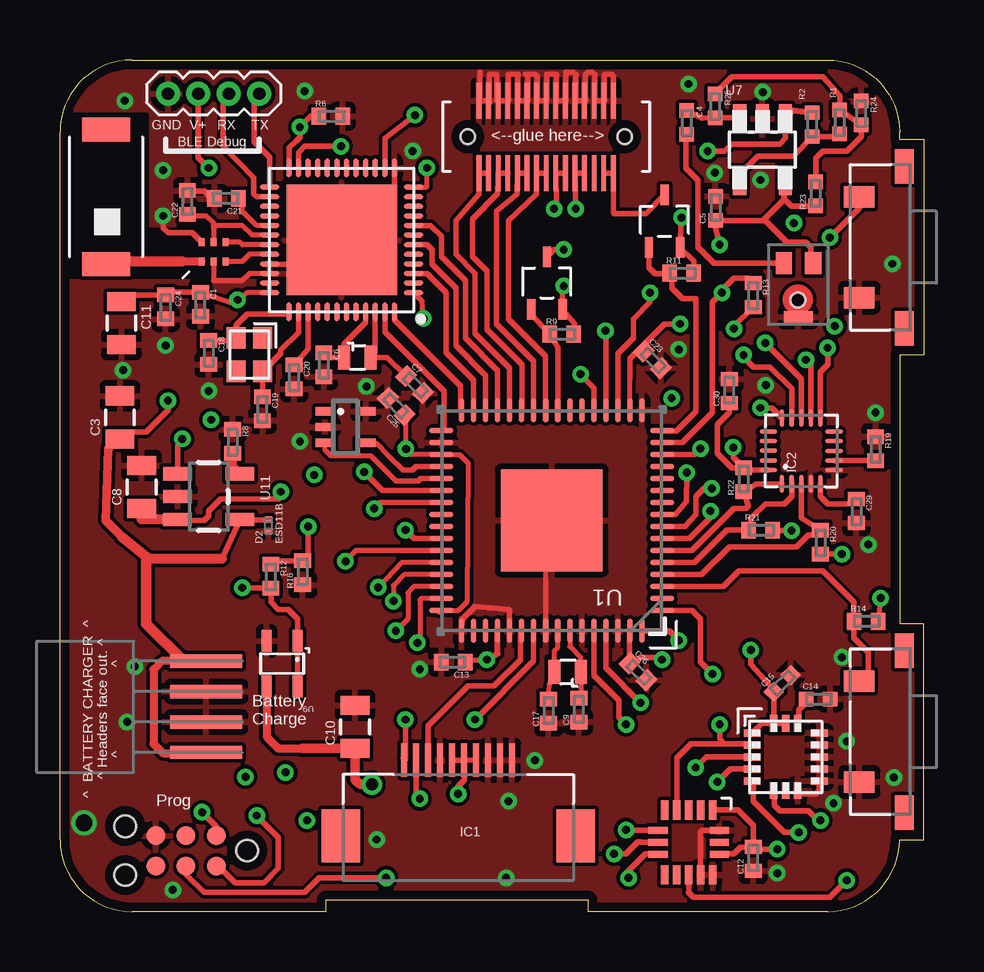
[diagram p4: board, top side]
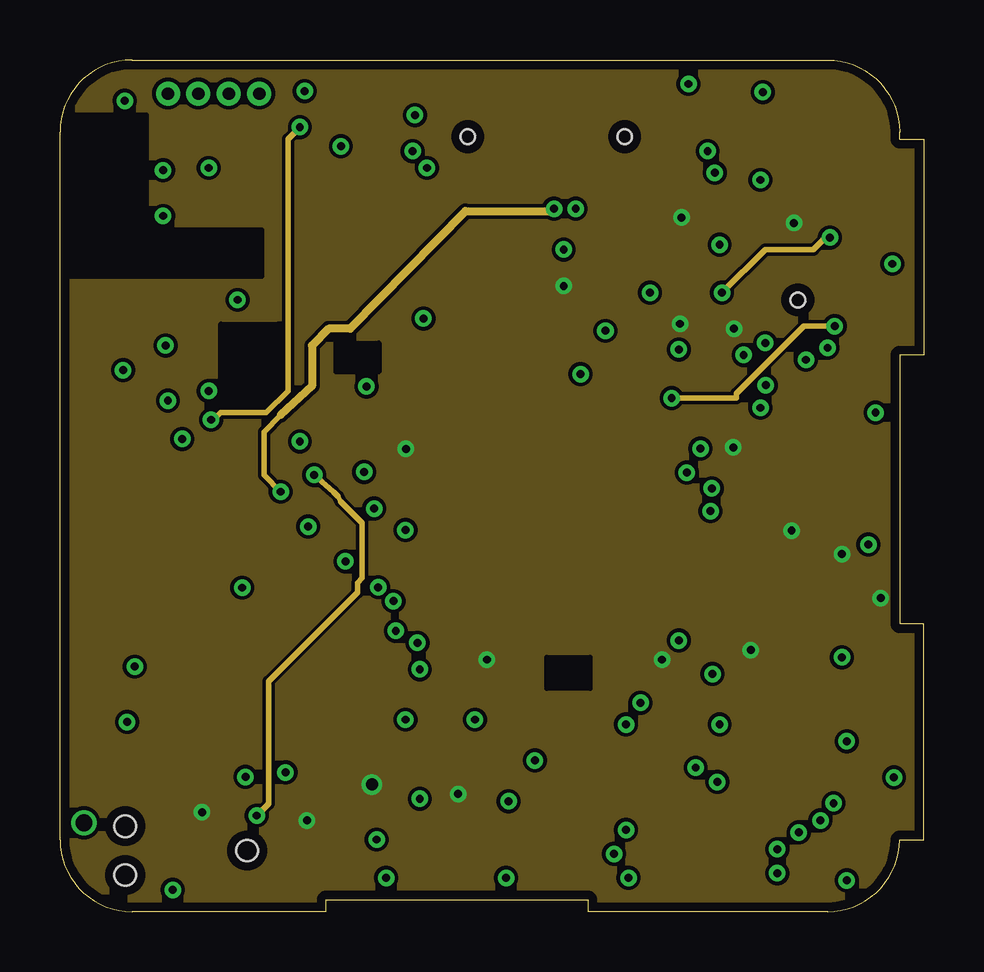
[diagram p5: board, inner layer Route2]
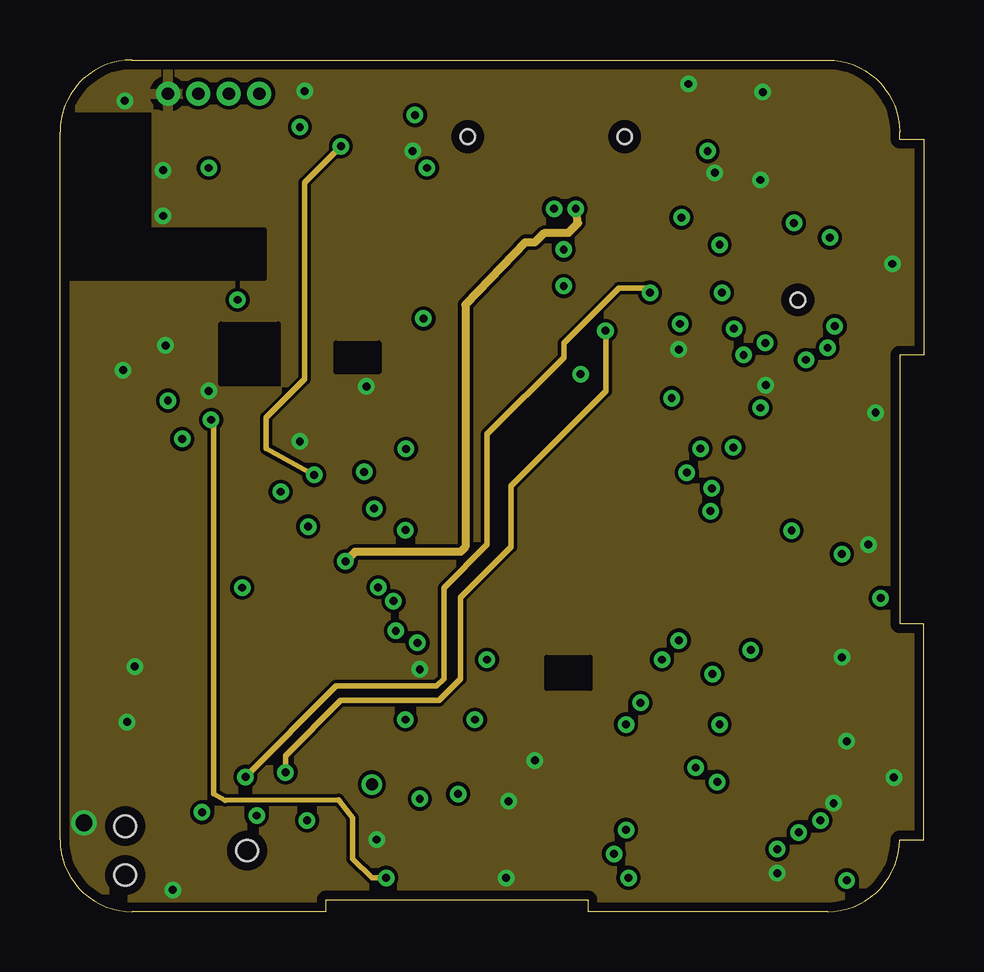
[diagram p6: board, inner layer Route15]
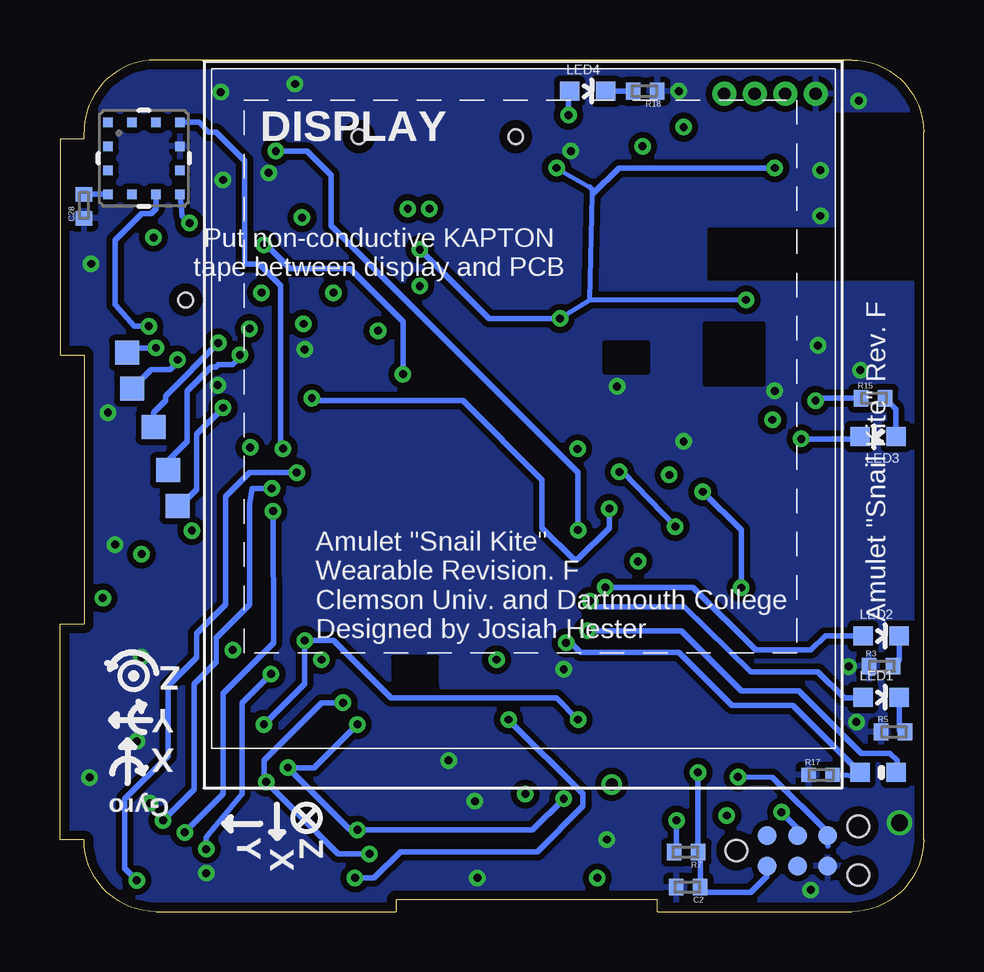
[diagram p7: board, bottom side, seen from below]

Size 36 x 35.5 mm. Coordinates in mm from the lower left corner, seen from the top.
Outline: 3,35.5 32,35.5 arc-90 35,32.5 35,32.2 36,32.2 36,23.2 35,23.2 35,12 36,12 36,3 35,3 arc-90 32,0 22,0 22,0.5 11.1,0.5 11.1,0 3,0 arc-90 0,3 0,32.5 arc-90 3,35.5
Copper layers (1*2*15*16): Top 0.0356mm / dielectric 1.5011mm / Route2 0.0356mm / dielectric 0.1499mm / Route15 0.0356mm / dielectric 0.2007mm / Bottom 0.0356mm
Design rules "LaenPCBOrder *": minimum track width 6mil, minimum drill 13mil, track to track 6mil, track to pad 6mil, pad to pad 6mil, via to via 6mil, smd to smd 6mil, copper to edge 15mil, drill to drill 6mil, minimum pad ring 7mil, minimum via ring 7mil, stop-mask expansion 3mil, vias tented up to drill 0mil, thermal gap 10mil

### Footprints (pad centres in the part's own frame; a part is rotated, then mirrored left to right if it is on the bottom)
0402 = smd 0.6 x 0.7: 1 -0.5,0; 2 0.5,0
0805 = smd 0.8 x 1.2: 1 -0.9,0; 2 0.9,0
0402' = smd 0.6 x 0.6: P$1 -0.49,0; P$2 0.51,0
DSN2 = smd 0.28 x 0.3: P$1 -0.24,0; P$2 0.23,0
FPC_10PIN_52892-1095 = smd 0.25 x 1.4: P$1 -2.25,0; P$2 -1.75,0; P$3 -1.25,0; P$4 -0.75,0; P$5 -0.25,0; P$6 0.25,0; P$7 0.75,0; P$8 1.25,0; P$9 1.75,0; P$10 2.25,0 | smd 1.6 x 2.2: SUPPORT1 -4.9,-3.15; SUPPORT2 4.9,-3.15
QFN-20-0.4MM-V2 = smd 0.75 x 0.195: 1 -1.367,0.8; 2 -1.367,0.4; 3 -1.367,0; 4 -1.367,-0.4; 5 -1.367,-0.8; 11 1.375,-0.8; 12 1.375,-0.4; 13 1.375,0; 14 1.375,0.4; 15 1.375,0.8 | smd 0.195 x 0.75: 6 -0.795,-1.372; 7 -0.395,-1.372; 8 0.005,-1.372; 9 0.405,-1.372; 10 0.805,-1.372; 16 0.81,1.372; 17 0.41,1.372; 18 0.01,1.372; 19 -0.39,1.372; 20 -0.79,1.372
TC2030-MCP-NL = smd 0.787 x 0.787: 1 1.27,-0.635; 2 1.27,0.635; 3 2.54,-0.635; 4 2.54,0.635; 5 3.81,-0.635; 6 3.81,0.635 | hole 0.889: 0,0; 5.08,-1.016; 5.08,1.016
TC2030-MCP-NODRILLS = smd 0.787 x 0.787: 1 -1.27,-0.635; 2 -1.27,0.635; 3 0,-0.635; 4 0,0.635; 5 1.27,-0.635; 6 1.27,0.635
RECEPTACLE-DF40-30-1.5MM = smd 0.2 x 1.5: 1 -2.8,-1.51; 2 -2.8,1.5; 3 -2.4,-1.51; 4 -2.4,1.5; 5 -2,-1.51; 6 -2,1.5; 7 -1.6,-1.51; 8 -1.6,1.5; 9 -1.2,-1.51; 10 -1.2,1.5; 11 -0.8,-1.51; 12 -0.8,1.5; 13 -0.4,-1.51; 14 -0.4,1.5; 15 0,-1.51; 16 0,1.5; 17 0.4,-1.51; 18 0.4,1.5; 19 0.8,-1.51; 20 0.8,1.5; 21 1.2,-1.51; 22 1.2,1.5; 23 1.6,-1.51; 24 1.6,1.5; 25 2,-1.51; 26 2,1.5; 27 2.4,-1.51; 28 2.4,1.5; 29 2.8,-1.51; 30 2.8,1.5 | hole 0.6: -3.27,0; 3.27,0
1X04-1.27MM = drill 0.508 pad 1: 1 0,0; 2 1.27,0; 3 2.54,0; 4 3.81,0
1X03-1.27MM = smd 3 x 0.56: 1 -1.5,-1.905; 2 -1.5,-0.635; 3 -1.5,0.635; 4 -1.5,1.905
LED-0603 = smd 0.8 x 0.8: A 0,-0.75; C 0,0.75
SC-70-3 = smd 0.85 x 0.35: P1 -1.1,0.65; P2 -1.1,-0.65; P3 1.1,0
TL3330AF130QG = smd 0.9 x 1.27: 1 -2.1,0.885; 2 2.1,0.885 | smd 1.45 x 0.8: P$1 -3.375,-1; P$3 3.375,-1
RGC0064B = smd 1 x 0.23: 1 -4.6,3.75; 2 -4.6,3.25; 3 -4.6,2.75; 4 -4.6,2.25; 5 -4.6,1.75; 6 -4.6,1.25; 7 -4.6,0.75; 8 -4.6,0.25; 9 -4.6,-0.25; 10 -4.6,-0.75; 11 -4.6,-1.25; 12 -4.6,-1.75; 13 -4.6,-2.25; 14 -4.6,-2.75; 15 -4.6,-3.25; 16 -4.6,-3.75; 33 4.6,-3.75; 34 4.6,-3.25; 35 4.6,-2.75; 36 4.6,-2.25; 37 4.6,-1.75; 38 4.6,-1.25; 39 4.6,-0.75; 40 4.6,-0.25; 41 4.6,0.25; 42 4.6,0.75; 43 4.6,1.25; 44 4.6,1.75; 45 4.6,2.25; 46 4.6,2.75; 47 4.6,3.25; 48 4.6,3.75 | smd 0.23 x 1: 17 -3.751,-4.6; 18 -3.251,-4.6; 19 -2.751,-4.6; 20 -2.251,-4.6; 21 -1.75,-4.6; 22 -1.25,-4.6; 23 -0.75,-4.6; 24 -0.25,-4.6; 25 0.25,-4.6; 26 0.75,-4.6; 27 1.25,-4.6; 28 1.75,-4.6; 29 2.251,-4.6; 30 2.751,-4.6; 31 3.251,-4.6; 32 3.751,-4.6; 49 3.751,4.6; 50 3.251,4.6; 51 2.751,4.6; 52 2.251,4.6; 53 1.75,4.6; 54 1.25,4.6; 55 0.75,4.6; 56 0.25,4.6; 57 -0.25,4.6; 58 -0.75,4.6; 59 -1.25,4.6; 60 -1.75,4.6; 61 -2.251,4.6; 62 -2.751,4.6; 63 -3.251,4.6; 64 -3.751,4.6 | smd 4.242 x 4.242: 65 0,0
ADXL362 = smd 0.8 x 0.3: P$1 -1.35,1; P$2 -1.35,0.5; P$3 -1.35,0; P$4 -1.35,-0.5; P$5 -1.35,-1; P$9 1.35,-1; P$10 1.35,-0.5; P$11 1.35,0; P$12 1.35,0.5; P$13 1.35,1 | smd 0.3 x 0.8: P$6 -0.5,-1.275; P$7 0,-1.275; P$8 0.5,-1.275; P$14 0.5,1.275; P$15 0,1.275; P$16 -0.5,1.275
LGA16L = smd 0.7 x 0.3: P1 -1.4,1; P2 -1.4,0.5; P3 -1.4,0; P4 -1.4,-0.5; P5 -1.4,-1; P9 1.4,-1; P10 1.4,-0.5; P11 1.4,0; P12 1.4,0.5; P13 1.4,1 | smd 0.3 x 0.7: P6 -0.5,-1.4; P7 0,-1.4; P8 0.5,-1.4; P14 0.5,1.4; P15 0,1.4; P16 -0.5,1.4
QFN-48-6MM = smd 0.8 x 0.203: 1 -3,2.2; 2 -3,1.8; 3 -3,1.4; 4 -3,1; 5 -3,0.6; 6 -3,0.2; 7 -3,-0.2; 8 -3,-0.6; 9 -3,-1; 10 -3,-1.4; 11 -3,-1.8; 12 -3,-2.2; 25 3,-2.2; 26 3,-1.8; 27 3,-1.4; 28 3,-1; 29 3,-0.6; 30 3,-0.2; 31 3,0.2; 32 3,0.6; 33 3,1; 34 3,1.4; 35 3,1.8; 36 3,2.2 | smd 0.203 x 0.8: 13 -2.2,-3; 14 -1.8,-3; 15 -1.4,-3; 16 -1,-3; 17 -0.6,-3; 18 -0.2,-3; 19 0.2,-3; 20 0.6,-3; 21 1,-3; 22 1.4,-3; 23 1.8,-3; 24 2.2,-3; 37 2.2,3; 38 1.8,3; 39 1.4,3; 40 1,3; 41 0.6,3; 42 0.2,3; 43 -0.2,3; 44 -0.6,3; 45 -1,3; 46 -1.4,3; 47 -1.8,3; 48 -2.2,3 | smd 4.6 x 4.6: GND 0,0
SC70-5L = smd 0.35 x 0.8: 1 -0.65,-0.85; 2 0,-0.85; 3 0.65,-0.85; 4 0.65,0.85; 5 -0.65,0.85
ADMP510 = smd 0.9 x 0.68: 1 0.887,-0.636; 2 0.887,0.584 | smd 0.5 x 1.2: 3 -1.37,-0.017 | hole 0.6: -0.65,0
SOT23-5 = smd 0.55 x 1.2: 1 -0.95,-1.3; 2 0,-1.3; 3 0.95,-1.3; 4 0.95,1.3; 5 -0.95,1.3
SC82-AB_1PRIMARY = smd 0.406 x 0.914: 1 -0.621,-0.913; 2 0.675,-0.913; 3 0.675,0.967; 4 -0.621,0.967
2450BM14E0003 = smd 0.25 x 0.35: 1 0.5,0.405; 2 0,0.405; 3 -0.5,0.405; 4 -0.5,-0.405; 5 0,-0.405; 6 0.5,-0.405
ML8511 = smd 0.4 x 0.4: 1 -1.5,-1.5; 2 -1.5,-0.5; 3 -1.5,0.5; 4 -1.5,1.5; 5 -0.5,1.5; 6 0.5,1.5; 7 1.5,1.5; 8 1.5,0.5; 9 1.5,-0.5; 10 1.5,-1.5; 11 0.5,-1.5; 12 -0.5,-1.5
ALS-PT19 = smd 0.8 x 0.8: C -0.75,0; E 0.75,0
CTPAD = smd 1 x 1: P$1 0,0
TXC-8Y = smd 0.9 x 0.8: 1 -0.7,-0.55; 2 0.7,-0.55; 3 0.7,0.55; 4 -0.7,0.55
ABS05 = smd 0.5 x 1: A -0.55,0; B 0.55,0
2450AT42A100 = smd 1 x 2.007: FEED 2.8,0; NC -2.8,0

### Placement (x,y rotation side)
C1  5.86,25.31 270 top
C2  9.81,1.02 180 bottom
C3  2.5,20.6 90 top
C4  1uF  [0402']  26.13,32.9 270 top
C5  0.1uF  [0402']  27.33,29.31 90 top
C6  11,22.8 270 top
C7  14.79,21.97 315 top
C8  3.4,17.7 90 top
C9  21.63,8.4 90 top
C10  12.3,7.7 90 top
C11  2.56,24.53 270 top
C12  28.9,2.2 90 top
C13  16.4,10.4 180 top
C14  10nF  [0402']  31.6,8.86 0 top
C15  0.1uF  [0402']  30.1,9.5 45 top
C17  20.37,8.35 90 top
C18  6.2,23.31 270 top
C19  8.44,20.96 270 top
C20  9.76,22.28 270 top
C21  6.94,29.73 180 top
C22  5.32,29.56 90 top
C23  24.7,23 315 top
C24  4.41,25.21 270 top
C25  14.02,21.06 135 top
C26  24.1,10 315 top
C28  35,29.4 90 bottom
C29  33.2,16.7 270 top
C30  27.9,21.7 90 top
D2  8.7,16.1 90 top
IC1  16.6,6.31 0 top
IC2  30.9,19.2 90 top
J1  7.8,2.54 0 bottom
J3  5.26,2.53 180 top
JP1  20.27,32.3 0 top
JP2  4.5,34.1 0 top
JP3  7.6,8.54 0 top
LED1  1.77,8.93 270 bottom
LED2  1.77,11.49 270 bottom
LED3  1.9,19.8 90 bottom
LED4  14,34.2 270 bottom
Q1  20.3,26.2 90 top
Q3  25.2,28.78 90 top
R1  5.49k  [0402']  32.5,32.93 270 top
R2  49.9k  [0402']  31.36,32.79 90 top
R3  1.77,10.23 0 bottom
R5  1.27,7.49 0 bottom
R6  11.29,33.15 0 top
R7  9.89,2.48 180 bottom
R8  7.2,19.6 270 top
R9  20.91,24.07 0 top
R11  25.92,26.61 0 top
R12  8.79,13.98 270 top
R13  28.9,25.7 270 top
R14  33.6,12.1 0 top
R15  2.1,21.4 0 bottom
R16  10.12,14.12 90 top
R17  10k  [0402']  4.3,5.7 0 bottom
R18  11.6,34.2 180 bottom
R19  34,19.3 270 top
R20  31.7,15.4 270 top
R21  29.2,15.9 0 top
R22  28.5,18 90 top
R23  100k  [0402']  31.5,29.9 90 top
R24  100k  [0402']  33.4,33.3 270 top
R25  10k  [0402']  27.31,33.6 270 top
S1  34.2,27.69 90 top
S2  34.2,7.5 90 top
U1  20.5,16.3 180 top
U2  26.21,2.88 270 top
U3  30.25,6.44 0 top
U4  11.74,28 180 top
U5  11.9,20.2 270 top
U6  30.76,26.14 90 top
U7  29.28,31.76 180 top
U9  9.29,10.36 180 top
U10  6.4,27.5 180 top
U11  6.2,17.3 270 top
U12  32.5,31.4 270 bottom
U13  1.9,5.8 180 bottom
U$3  16.7,20.3 0 bottom
U$6  31.1,16.9 270 bottom
U$7  31.5,18.4 270 bottom
U$8  32.1,20.2 270 bottom
U$9  33,21.8 270 bottom
U$10  33.2,23.3 270 bottom
X1  7.9,23.22 270 top
X2  21.17,9.98 180 top
X3  12.4,23.1 0 top
Y1  1.92,29.8 270 top

### Tracks (layer width: path | path; a pad name or v marks a point on that pad's centre or on a via)
!BLE_CS
  Top 0.222: U1.30 17.75,22.35 16.5,23.6 16.5,26 15.5,27 15.5,27.6 15.3,27.8 U4.6
!BLE_ENABLE
  Top 0.222: U1.24 20.75,23.52 R9.1 19.65,24.88 Q1.P1
!CS_GYRO  (via drill 0.33)
  Top 0.222: U1.7 26.25,15.55 27.1,16.4 v27.12,16.69 | v30.8,3.3 30.2,3.3 28.9,4.6 28.9,5.39 U3.P5
  Bottom 0.222: v27.12,16.69 27.1,11.2 29.2,9.1 29.2,4.9 v30.8,3.3
!CS_SD
  Top 0.22: 18.7,27.5 18.7,28.8 19.87,29.9 JP1.13 JP1.15
  Top 0.222: U1.25 20.25,23.15 18.7,24.7 18.7,27.5
!CS_XL  (via drill 0.33)
  Top 0.222: U1.55 19.75,10.45 v17.3,8 | v23.7,1.4 23.7,1.7 24.4,2.4 24.91,2.4 U2.P$8
  Bottom 0.222: v17.3,8 14.2,4.9 14.2,4.4 16.1,2.5 21.8,2.5 22.9,1.4 v23.7,1.4
!SD_ENABLE
  Top 0.222: U1.16 25.7,20.04 26.5,20.84 26.5,25.56 25.94,25.56 25.5,26 25.5,26.53 R11.1 24.8,26.6 24.55,26.85 Q3.P1
ADC_BATT  (via drill 0.33)
  Top 0.222: U1.38 13.45,17.55 v12.68,18.33 | v10.35,16.05 10.35,14.85 R16.2 9.19,14.62 R12.1
  Bottom 0.222: v12.68,18.33 12.53,18.33 v10.35,16.05
AMP_VREF(VCC/2)
  Top 0.222: R25.P$1 28.02,34.8 31.8,34.8 32.51,34.02 R1.P$1 R24.P$2 33.4,32.3 32.8,31.7 31.8,31.7 31.5,31.4 R23.P$2 31.59,30.5
BLE_LPINT/UCA0SCLK
  Top 0.222: U1.31 17.25,22.15 16.1,23.3 16.1,25.8 15.3,26.6 U4.3
BLE_RDY
  Top 0.222: U1.29 18.25,22.55 16.9,23.9 16.9,26.3 15.9,27.3 15.9,28.15 15.45,28.6 U4.8
BUTTON1  (via drill 0.33)
  Top 0.222: U1.15 25.95,19.55 27.2,20.8 27.2,25.4 v27.6,25.8 27.6,25.9 28.1,26.4 28.7,26.4 R13.1 | S1.2 33.31,29.32 v32.1,28.1
  Route2 0.222: v32.1,28.1 31.9,28.1 31.4,27.6 29.4,27.6 v27.6,25.8
BUTTON2
  Top 0.222: U1.3 27.65,13.55 28.3,14.2 31.8,14.2 33.1,12.9 R14.1 33.1,11.4 33.7,10.8 33.7,9.98 S2.2
BUZZER  (via drill 0.33)
  Top 0.22: JP1.21 JP1.23
  Top 0.222: v11.9,14.6 12.35,15.05 U1.43 | JP1.21 v21.5,29.3
  Route15 0.33: 19.4,27.9 19.8,27.9 20.2,28.3 21.2,28.3 21.6,28.7 v21.5,29.3
  Route15 0.333: 19.4,27.9 16.9,25.3 16.9,15.2 16.7,15 12.3,15 v11.9,14.6
CS_DISPLAY
  Top 0.222: IC1.P$3 15.35,7.75 17,9.4 18.1,9.4 19.2,10.5 19.2,11.65 U1.54
CT_IRQ
  Top 0.222: IC2.1 29.03,17.83 R22.1 28.7,16.9 28.6,16.8 28.1,16.8 26.35,15.05 U1.6
DEBUG_BLE_RX
  Top 0.222: U4.26 8.2,29.8 8.07,29.9 8.07,30.6 6.8,31.9 6.8,33.86 JP2.3
DEBUG_BLE_TX
  Top 0.222: U4.25 8.74,31.46 8.1,32.1 8.1,33.89 JP2.4
ELE3  (via drill 0.33)
  Top 0.222: IC2.11 31.7,22.5 32,22.8 v32,23.5
  Bottom 0.222: v32,23.5 33.5,23.5 U$10.P$1
ELE4  (via drill 0.33)
  Top 0.222: IC2.12 31.3,22.8 v31.1,23
  Bottom 0.222: v31.1,23 31.1,22.9 31.4,22.6 32.2,22.6 U$9.P$1
ELE5  (via drill 0.33)
  Top 0.222: IC2.13 30.9,22.2 v29.4,23.7
  Bottom 0.222: v29.4,23.7 31.6,21.5 31.6,21.3 32.1,20.8 U$8.P$1
ELE6  (via drill 0.33)
  Top 0.222: IC2.14 30.5,21.8 29.6,22.7 28.9,22.7 28.5,23.1 v28.5,23.2
  Bottom 0.222: U$7.P$1 31.5,18.8 30.7,19.6 30.7,21.7 29.7,22.7 29.5,22.7 29.4,22.8 28.8,22.8 28.5,23.1 v28.5,23.2
ELE7  (via drill 0.33)
  Top 0.222: IC2.15 29.68,21 v29.2,21
  Bottom 0.222: v29.2,21 30.3,19.9 30.3,17.6 31,16.9 U$6.P$1
FROMBLE_RX/UCA0SOMI
  Top 0.222: U1.32 16.7,20.95 16.7,21.9 13.94,24.66 U4.48
GND  (via drill 0.33, 0.7)
  Top 0.2: U4.34 7.9,26.6 | U4.33 11.3,27 11.7,27.4 11.7,27.96 U4.GND 13.94,30.2 U4.13 | U1.56 20.25,16.05 U1.65 | U10.2 6.4,26.3
  Top 0.222: U1.49 16.76,12.17 17.31,12.72 18.7,12.6 18.75,12.55 U1.53 | 7.9,26.6 7.6,26.3 6.4,26.3 | U10.6 5.5,28.3 4.5,28.3 4.3,28.5 4.3,28.7 | U2.P$16 26.78,3.38 26.7,3.3 U2.P$12 | U3.P8 30.89,4.9 31.5,4.9 31.65,5.05 U3.P9 | JP1.30 23.07,34.83 23,34.9 22.7,34.9 22.7,33.8 22.3,33.8 22.3,34.9 22.2,35 22,35 21.9,34.9 21.9,33.8 21.5,33.8 21.5,34.9 21.4,35 21.1,35 21.1,33.8 20.7,33.8 20.7,34.9 20.3,34.9 20.3,33.8 19.9,33.8 19.9,34.8 19.8,34.9 19.5,34.9 | 19.4,34.9 19.5,34.9 | 19.5,34.9 19.5,33.8 19.1,33.8 19.1,34.9 18.7,34.9 18.7,33.8 18.2,33.8 18.2,34.9 17.9,34.9 17.9,33.8 | 17.9,33.7 17.9,33.8 | 17.9,33.8 17.5,33.8 17.5,35 | C21.2 6.33,29.73 6.02,30.04 5.33,30.04 C22.2
  other vias: 33.7,15.3 4.4,23.6 1,3.7 4.7,0.9 25.8,23.43 12.78,21.89 15,10.1 10.2,34.2 6.2,21.7 32.6,10.6 34.77,5.59 13.2,3 14.7,31.7 4.3,29 4.3,30.9 2.7,33.8 29.3,34.16 2.63,22.57 27.3,30.8 29.9,1.6 32.8,7.1 32.25,4.52 19.8,6.3 29.2,30.5 34,20.8 34.7,27 18.7,4.6 18.6,1.4 10,19.6 26.2,34.5 2.8,7.9 3.12,10.21 29.42,21.94
  pour Top (isolate 0.05): -1.16,35.3 37.04,35.6 37.04,-0.2 -1.16,-0.5
  pour Route15: -1.1,35.7 36.6,35.8 36.6,-0.2 -1.1,-0.3
  pour Bottom (isolate 0.254): 37.04,35.7 -1.16,35.4 -1.16,-0.4 37.04,-0.1
GYRO_DRDY  (via drill 0.33)
  Top 0.222: U1.8 26.05,16.05 26.5,16.56 26.5,17.3 26.84,17.64 v27.17,17.64 | v31.7,3.8 31.6,3.8 31.2,4.2 30.01,4.2 29.78,4.43 29.78,5.01 U3.P6
  Bottom 0.222: v31.7,3.8 30.4,5.1 30.4,9.5 29.5,10.4 29.5,11.4 28.1,12.8 28.1,17 28,17.63 27.99,17.64 v27.17,17.64
LED1  (via drill 0.33)
  Top 0.2: U1.45 14.35,14.05 13.9,13.6 v13.9,12.94
  Bottom 0.222: LED1.A 2.55,8.9 3.3,8.9 4.4,10 7.2,10 9.97,12.7 13.7,12.7 13.9,12.9 v13.9,12.94
LED2  (via drill 0.33)
  Top 0.2: U1.44 14.25,14.55 v13.27,13.52
  Bottom 0.222: v13.27,13.52 9.62,13.52 7,10.9 4.7,10.9 4.1,11.5 LED2.A
LIGHT_PWR  (via drill 0.33)
  Top 0.2: U1.46 14.75,13.55 14.5,13.3 14.5,12.2 v14,11.7
  Bottom 0.222: v14,11.7 10.1,11.7 7.6,9.2 5.2,9.2 2.6,6.6 1.4,6.6 1.1,6.3 1.1,5.85 U13.C
MIC_AMP-
  Top 0.222: U7.4 28.33,30.73 29.1,31.5 30.57,31.5 R2.P$1 32.55,32.3 R1.P$2
MIC_OUT
  Top 0.222: C4.P$2 26.1,32.36 26.1,31 26.6,30.5 26.6,27.7 27.27,27.03 U6.2
MIC_PWR  (via drill 0.33)
  Top 0.222: U1.21 22.27,20.92 22.27,21.83 v21.7,22.4 | v27.5,27.8 27.32,28.52 C5.P$1 27.35,28.8 29.3,28.8 | 29.3,28.8 29.9,29.4 | 29.3,28.8 29.4,28.8 30.3,27.9 31.1,27.9 31.3,27.7 31.3,27.13 U6.1 | R23.P$1 30.49,29.41 30.2,29.7
  Top 0.25: 29.9,29.4 30.2,29.7 30.2,30.43 U7.5
  Bottom 0.222: v21.7,22.4 21.7,24.6 23.9,26.8 26.4,26.8 27.4,27.8 v27.5,27.8
MSP430_RST  (via drill 0.33)
  Top 0.222: v22.74,24.21 22.75,24.2 U1.20
  Route15 0.222: v22.74,24.21 22.75,24.2 22.75,21.7 18.8,17.75 18.8,15.2 16.7,13.1 16.7,9.7 15.8,8.8 11.7,8.8 9.4,6.5 v9.4,5.8
  Bottom 0.222: J1.1 6.54,1.47 7.2,0.8 9.09,0.8 C2.1 9.31,2.4 R7.1 v9.4,5.8
MSP430_TEST  (via drill 0.33)
  Top 0.222: U1.19 23.25,23.25 23.9,23.9 23.9,24.7 24.6,25.4 v24.6,25.8
  Route15 0.222: v7.73,5.61 11.5,9.4 15.7,9.4 16,9.7 16,13.5 17.8,15.3 17.8,19.9 21,23.1 21,23.7 23.3,26 24.4,26 v24.6,25.8
  Bottom 0.222: v7.73,5.61 6.3,5.6 4,3.3 4,2.75 J1.6
N$1
  Bottom 0.222: LED2.C 1.02,10.48 R3.2
N$2
  Bottom 0.222: R5.2 1.02,7.54 LED1.C
N$3
  Top 0.35: U11.5 7.2,18.55 R8.2
N$5
  Top 0.2: C17.2 20.4,9.46 X2.B 20.62,10.89 20.75,11.02 U1.57 | U1.57
N$6
  Top 0.2: C9.2 21.72,8.99 X2.A 21.7,10 21.7,10.6 21.25,11.05 U1.58
N$7  (via drill 0.33)
  Top 0.22: U11.1 4.9,19.4 v5.1,19.7
  Bottom 0.22: v5.1,19.7 2.75,19.7 LED3.C
N$8
  Top 0.222: C14.P$1 31.11,8.71 30.8,8.4 30.8,7.89 U3.P14
N$9
  Bottom 0.22: LED3.A 1.15,20.95 R15.2
N$10
  Top 0.222: Y1.FEED 1.92,27.02 2,27.1
  Top 0.333: U10.1 5.09,27.09
  Top 0.406: 5.09,27.09 5.09,27.1 2,27.1
N$11
  Top 0.2: U4.30 8,28.2 7.6,28.6 6.5,28.6 6.4,28.5 | 6.4,28.5 U10.5 | 6.4,28.5 6.4,28.7 6.1,29 5.08,29 C22.1
N$12
  Top 0.2: U4.31 7.6,27.8 7.5,27.9 U10.4
N$13
  cutout Top: 0.1,33.2 3.6,33.2 3.6,28.4 8.4,28.4 8.4,26.5 0.1,26.5
N$14
  cutout Route2: 0.1,33.2 3.6,33.2 3.6,28.4 8.4,28.4 8.4,26.5 0.1,26.5
N$15
  cutout Bottom: 6.7,24.5 9.1,24.5 9.1,22 6.7,22
N$16
  cutout Route15: 0.1,33.2 3.7,33.2 3.7,28.4 8.5,28.4 8.5,26.4 0.1,26.4
N$17
  cutout Bottom: 0.1,33.2 3.6,33.2 3.6,28.4 8.9,28.4 8.9,26.4 0.1,26.4
N$18
  cutout Route15: 6.7,24.5 9.1,24.5 9.1,22 6.7,22
N$19
  Top 0.2: C6.1 11.2,23.1 X3.A
  Top 0.222: U4.45 12.74,24.54 11.85,23.65 X3.A 11.75,22.89
N$20
  Top 0.222: C7.1 13.64,23.1 X3.B 13.14,23.29 U4.46
N$21
  cutout Route2: 6.7,24.5 9.1,24.5 9.1,22 6.7,22
N$22
  cutout Route2: 11.5,23.7 13.3,23.7 13.3,22.5 11.5,22.5
N$23
  cutout Route15: 11.5,23.7 13.3,23.7 13.3,22.5 11.5,22.5
N$24
  cutout Bottom: 11.5,23.7 13.3,23.7 13.3,22.5 11.5,22.5
N$25
  cutout Top: 11.5,23.7 13.3,23.7 13.3,22.5 11.5,22.5
N$26
  cutout Top: 20.3,10.6 22.1,10.6 22.1,9.3 20.3,9.3
N$27
  cutout Route2: 20.3,10.6 22.1,10.6 22.1,9.3 20.3,9.3
N$28
  cutout Route15: 20.3,10.6 22.1,10.6 22.1,9.3 20.3,9.3
N$29
  Top 0.2: U4.32 7.9,27.4 7.6,27.1 U10.3
N$30
  cutout Bottom: 20.3,10.6 22.1,10.6 22.1,9.4 20.3,9.4
N$31
  Top 0.222: U4.37 9.44,24.9 7.8,24.9 7.35,24.45 X1.1 7.23,23.8 C18.1
N$32
  Top 0.222: U4.38 9.94,24.14 9.2,23.4 9.2,23.27 X1.3 8.44,22.51 C19.1
N$33
  Top 0.222: U4.39 10.34,23.45 C20.1
N$34
  Top 0.2: U4.29 8.2,28.6 7.6,29.2 7.6,29.36 C21.1
N$36
  Bottom 0.222: LED4.C R18.2
N$37  (via drill 0.33)
  Top 0.222: U4.14 13.54,32.24 v14.8,33.2
  Bottom 0.222: v14.8,33.2 14.8,34.15 LED4.A
N$38
  Bottom 0.222: U12.10 C28.2
N$41
  Top 0.222: U7.3 28.31,33.09 R25.P$2 26.79,33.07 C4.P$1
REXT
  Top 0.222: IC2.7 33.3,18.8 R19.2
SCL
  Top 0.222: IC2.2 30.5,17.3 30.2,17 29.4,17 28.8,16.4 28.8,16 R21.1 27.8,15.9 26.45,14.55 U1.5
SCLK  (via drill 0.33)
  Top 0.222: 14.3,6.4 14.35,6.35 IC1.P$1 14.4,6.36 v14.4,8 | U2.P$4 25.71,6.41 26.3,7 27.7,7 | 27.7,7 28.79,7 U3.P2 | U1.64 25.4,11.7 v25.8,11.3 | v27.5,7.8 27.5,7.2 27.7,7
  Bottom 0.222: v14.4,8 15.3,8.9 22.2,8.9 24.6,11.3 v25.8,11.3 25.8,9.5 v27.5,7.8
SD_CLK
  Top 0.22: 16.5,27.4 16.5,28.8 17.46,29.9 JP1.1 JP1.3
  Top 0.222: U1.28 18.75,22.65 17.3,24.1 17.3,26.6 16.5,27.4
SD_SIMO
  Top 0.22: 18.2,27.6 18.2,29.2 19.05,29.91 JP1.9 JP1.11
  Top 0.222: U1.26 19.75,22.95 18.2,24.5 18.2,27.6
SD_SOMI
  Top 0.22: 17.2,27.3 17.2,28.87 18.24,29.92 18.26,30.58 JP1.5 JP1.7
  Top 0.222: U1.27 19.26,22.8 17.8,24.26 17.8,26.7 17.2,27.3
SD_VCC
  Top 0.22: JP1.29 JP1.27
  Top 0.222: JP1.29 23.07,29.13 23.1,29.1 24.42,29.1 Q3.P3
SDA
  Top 0.222: IC2.3 30.9,16.4 R20.1 31.5,15.7 31.2,15.7 30.7,15.2 27.9,15.2 26.75,14.05 U1.4
SIMO  (via drill 0.33)
  Top 0.222: U3.P3 26.94,6.44 v26.5,6 | v23.6,3.4 23.62,3.38 U2.P$6 | U1.60 22.25,9.85 23.3,8.8 23.3,8.1 v23.6,7.8 | IC1.P$2 14.85,4.85 v15,4.7
  Bottom 0.222: v23.6,7.8 25.4,6 v26.5,6 23.9,3.4 v23.6,3.4 16.3,3.4 v15,4.7
SOMI  (via drill 0.33)
  Top 0.222: U3.P4 27.94,5.94 v27.4,5.4 | v23.1,2.4 23.6,2.4 24.1,2.9 24.2,2.9 24.22,2.88 U2.P$7 | U1.61 22.75,10.15 v24.2,8.7
  Bottom 0.222: v23.1,2.4 24.4,2.4 v27.4,5.4 27.5,5.5 27.5,6.3 25.1,8.7 v24.2,8.7
SWDCLK  (via drill 0.33)
  Top 0.22: v13.6,1.4 11.1,1.4
  Top 0.222: U4.24 9.54,31.84 9.85,32.12 10,32.27 v10,32.7 10.45,33.15 R6.1 | J3.4 5.26,1.54 6,0.8 10.2,0.8 10.8,1.4 11.1,1.4
  Route2 0.22: 9.5,28.6 9.5,21.7 8.6,20.8 6.7,20.8 6.4,20.5 v6.3,20.5
  Route2 0.222: 9.5,28.6 9.5,32.2 v10,32.7
  Route15 0.22: v6.3,20.5 6.4,20.4 6.4,4.9 6.89,4.64 11.61,4.65 12.2,3.9 12.2,2.2 13,1.4 v13.6,1.4
SWDIO/!RESET  (via drill 0.33)
  Top 0.22: 9.94,31.64 10.2,31.9 v11.71,31.9
  Top 0.222: U4.23 9.94,31.64 | J3.2 6.61,1.9 7.3,1.2 8.5,1.2 9.1,1.8 9.1,3.1 v8.2,4
  Route2 0.22: v8.2,4 8.7,4.5 8.7,9.6 12.4,13.3 12.4,13.7 12.6,13.9 12.6,16.2 11.7,17.1 11.6,17.3 11.4,17.5 v10.6,18.2
  Route15 0.22: v10.6,18.2 8.6,19.3 8.6,20.6 10.2,22.2 10.2,29.8
  Route15 0.222: 10.2,29.8 10.2,30.39 v11.71,31.9
TEMP_PWR
  Top 0.2: U5.4 13.15,19.55 13.7,19
  Top 0.222: U1.36 14.85,18.55 14.7,18.4 14.3,18.4 13.7,19
TOBLE_TX/UCA0SIMO
  Top 0.222: U1.33 16,20.15 16,21.7 13.54,24.16 U4.47
UV_ADC  (via drill 0.33)
  Top 0.222: U1.39 13.35,17.05 v13.1,16.8
  Route2 0.222: v25.5,21.4 28.2,21.4 28.2,21.6 31,24.4 v32.3,24.4
  Bottom 0.222: v13.1,16.8 13.1,16 14.4,14.7 14.6,14.7 15.9,16 15.9,18 19.2,21.3 25.4,21.3 v25.5,21.4 | v32.3,24.4 32.9,24.4 33.7,25.3 33.7,28 32.6,29.1 32.2,29.1 32,29.3 U12.8
UV_PWR  (via drill 0.33)
  Top 0.222: U1.14 26.45,19.05 v26.7,19.3
  Bottom 0.222: v26.7,19.3 26.8,19.4 26.8,26.1 27.7,27 28.3,27 28.3,31.3 29.5,32.5 29.8,32.5 30.2,32.9 U12.4
V+  (via drill 0.33)
  Top 0.2: U4.35 U4.36 7.8,25.8 v7.4,25.5 7.24,25.34 C1.1 | v15.15,24.72 15.1,25.44 U4.1 | U4.12 15.3,30.2 v15.3,31
  Top 0.222: Q1.P3 20.6,27.6 v21,27.6 | C11.1 2.84,25.71 C24.1 4.51,25.81 C1.1 | JP2.2 5.77,31.43 v6.2,31
  Bottom 0.2: v7.4,25.5 13.9,25.5 | 13.9,25.5 v15.15,24.72 | 13.9,25.5 13.8,29.9 13.8,30.1 13.9,30.2 v15.3,31
  Bottom 0.222: v21,27.6 18.12,24.72 v15.15,24.72 | v6.2,31 12.71,31 13.8,29.9
VADC_LIGHT  (via drill 0.33)
  Top 0.2: U1.47 15.05,13.05 15,13 15,11.3 v14.9,11.2
  Bottom 0.222: R17.P$2 2.51,5.66 U13.E 5.45,8.6 8,8.6 10.2,10.8 14.3,10.8 14.7,11.2 v14.9,11.2
VADC_MIC  (via drill 0.33)
  Top 0.222: U7.1 30.23,32.23 30,32 28,32 27.7,31.7 v27,31.7 | U1.42 14.75,15.55 v14.4,15.9
  Top 0.25: U7.1 30.57,33.4 R2.P$2
  Bottom 0.222: v14.4,15.9 14.4,18.3 24.7,28.6 24.7,30.7 25.7,31.7 v27,31.7
VADC_TEMP
  Top 0.2: 14.02,17.95 12.97,19 11.3,19 11.05,19.25 U5.3
  Top 0.222: U1.37 15.04,18.05 14.94,17.95 14.02,17.95
VBAT  (via drill 0.33)
  Top 0.22: JP1.17 JP1.19
  Top 0.222: JP1.17 20.69,29.5 v20.6,29.3 | U9.4 U9.1 9.91,12.19 9.5,12.6 9.1,12.6 8.8,12.9 R12.2 7.62,13.48 v7.6,13.5 | v9.2,17.5 9.2,17.3 9.1,17.2 6.7,17.2 6.2,16.7 6.2,16.5 6,16.3 4.95,16.3 U11.3
  Top 0.406: U11.3 3.4,16.35 C8.1
  Route2 0.222: 9.2,20.7 8.5,20 8.5,18.2 v9.2,17.5
  Route2 0.33: 16.9,29.2 20.5,29.2 v20.6,29.3
  Route2 0.333: 16.9,29.2 12.1,24.3 11.2,24.3 10.5,23.6 10.5,21.9 9.2,20.7
  Bottom 0.222: v7.6,13.5 7.6,15.9 v9.2,17.5
VCC  (via drill 0.33, 0.5)
  Top 0.2: 15.8,19.05 U1.35 | v34.21,13.07 R14.2 | U1.18 23.75,22.19 | U1.35 14.65,19.05 v14.42,19.29 14.42,20.66 C25.1 | U1.35 16.66,19.05 17.02,18.7 16.96,12.91 16.59,12.54 15.81,12.54 U1.48 | IC1.P$7 IC1.P$6 | C13.1 17.1,10.5 v17.8,10.5
  Top 0.222: U1.48 15.86,12.51 15.81,12.51 15.8,12.5 | R9.2 21.44,24.51 Q1.P2 20.95,26.03 v21,26.08 | 23.75,22.19 23.75,23.05 24.15,23.45 | 24.15,23.45 25.2,24.5 v25.85,24.5 | C23.1 24.25,23.45 24.15,23.45 | Q3.P2 25.9,28.85 v25.91,28.93 | Q3.P2 25.85,27.95 | v30.5,15.88 29.72,15.88 R21.2 | R20.2 v32.6,14.9 | IC1.P$5 IC1.P$6 16.86,5.48 16.6,5.22 v16.6,4.9 | U1.63 C26.1 23.95,10.35 24.2,10.6 25,10.6 v25.1,10.5 | R22.2 28.59,18.41 IC2.20 | C30.1 27.9,20.8 27.4,20.3 27.4,19.1 28,18.5 R22.2 | v28.07,19.35 28.07,18.93 R22.2 | J3.1 6.53,3.53 v5.92,4.14 | U3.P16 C15.P$1 29.75,9.25 28.8,10.3 v28.8,10.9 | U3.P16 U3.P15 | U3.P16 29.25,7.84 U3.P1 | v28.1,24.3 28.1,24.4 R13.2 | R11.2 26.42,27.11 Q3.P2
  Top 0.25: v17.8,10.5 18.25,10.75 U1.52
  Top 0.333: U9.3 8.62,7.29 9.1,6.8 10.6,6.8
  Top 0.4: 10.1,6.8 10.6,6.8 C10.1 12.3,5.5 12.5,5.3 v13,5.3
  Bottom 0.222: v30.6,28.7 30.9,29 U12.7 | v10.3,3.8 10.3,2.57 R7.2 | J1.4 5.26,3.46 v5.92,4.14
  pour Route2: -1.1,35.7 36.6,35.8 36.6,-0.2 -1.1,-0.3
VIN  (via drill 0.33)
  Top 0.22: v4.5,21.3 4.5,20.9 3.6,20 3,20 C3.1
  Top 0.222: 6.76,14.71 U11.4 7.52,16.33 D2.P$2
  Top 0.33: 6.84,10.45 JP3.4 4.25,10.45 3.9,10.1 3.9,7 4.3,6.6 6.07,6.6 JP3.1
  Top 0.35: U11.4 7.55,16.4 | 2.59,15.61 1.9,16.3 2,19.3 C3.1
  Top 0.406: 2.59,15.61 3.7,14.71 6.76,14.71
  Top 0.44: 6.84,10.45 5.16,10.45 3.6,12 3.6,14.61 3.7,14.71
  Bottom 0.22: R15.1 4.4,21.4 v4.5,21.3
VREG
  Top 0.222: IC2.5 31.7,17.3 32,17 32.8,17 C29.1
XL_INT1  (via drill 0.33)
  Top 0.222: U1.9 25.65,16.55 26.12,17.1 v26.13,18.3 | v32.8,1.3 32.1,0.6 26.4,0.6 26.2,0.8 26.21,0.81 U2.P$11
  Bottom 0.222: v26.13,18.3 28.1,18.3 29.1,17.3 29.1,12.8 30.3,11.6 30.3,10.6 31.5,9.4 31.5,6.5 33.3,4.7 33.3,1.8 v32.8,1.3
XL_PWR  (via drill 0.33)
  Top 0.222: U2.P$1 28.27,4.23 28.9,3.6 C12.2 | U2.P$14 27.5,2.4 28.09,2.4 28.36,2.67 28.87,2.67 C12.2 | v29.9,2.6 29.7,2.7 29.6,2.6 29,2.6 C12.2 | U1.1 26.35,12.55 26.7,12.2 26.7,10.4 v27.2,9.9
  Bottom 0.222: v27.2,9.9 28.4,8.7 28.4,4.9 29.9,3.1 v29.9,2.6

### Text on the board
tPlace: GND | V+ | RX | TX | BLE Debug | <--glue here--> | ^ BATTERY CHARGER ^ / ^ Headers face out. ^ / ^ ^ | Battery / Charge | Prog
bPlace: Put non-conductive KAPTON / tape between display and PCB | Amulet "Snail Kite" Rev. F | Amulet "Snail Kite" / Wearable Revision. F / Clemson Univ. and Dartmouth College / Designed by Josiah Hester | Z | Y | X | Gyro | Z | X | Y